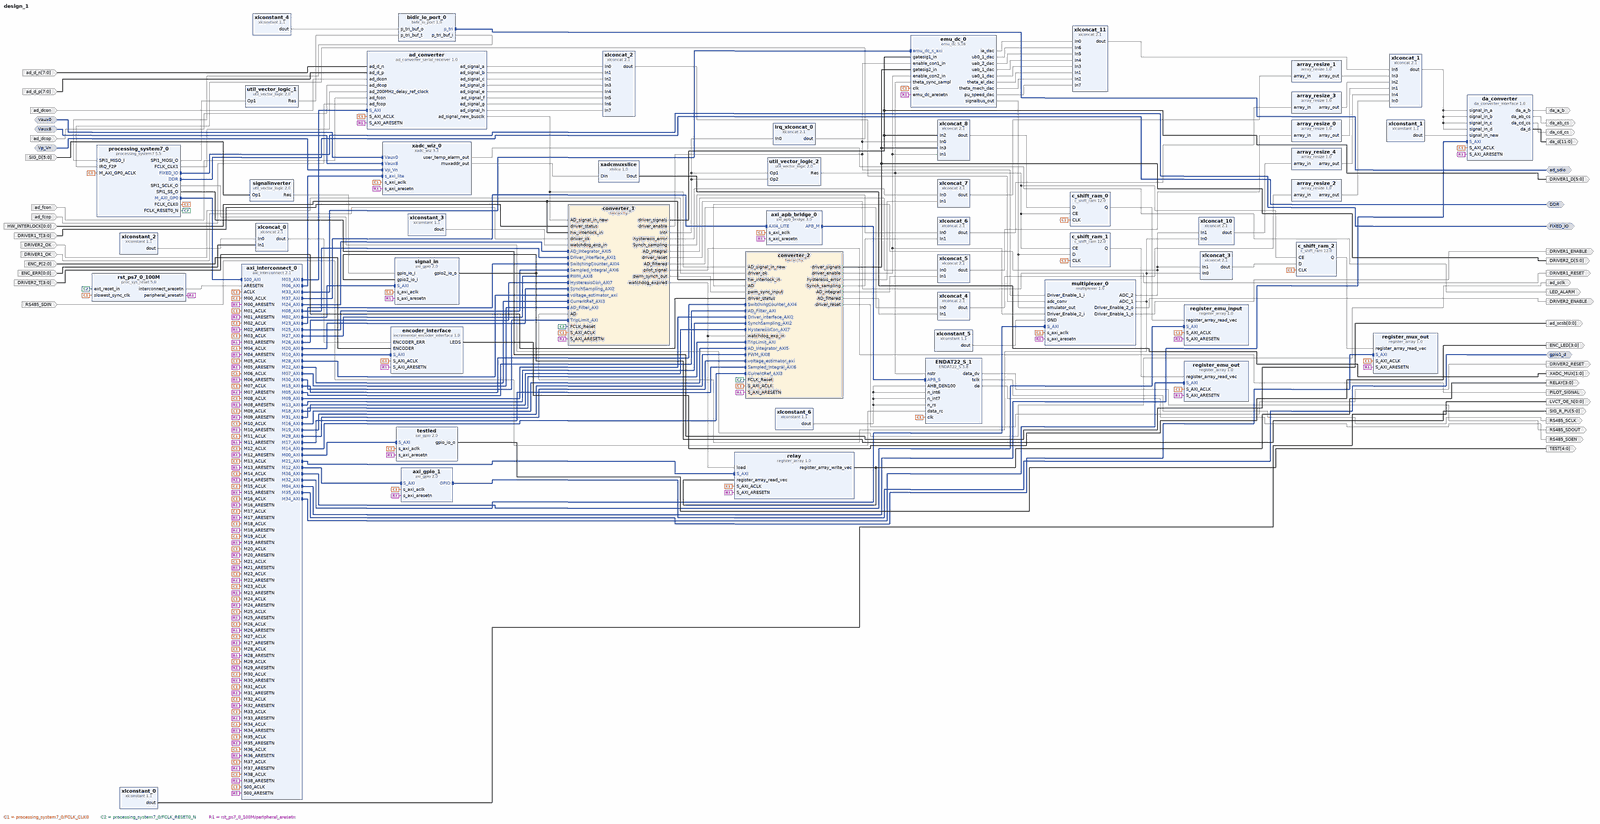
[diagram p0: block diagram of the top level, whole]
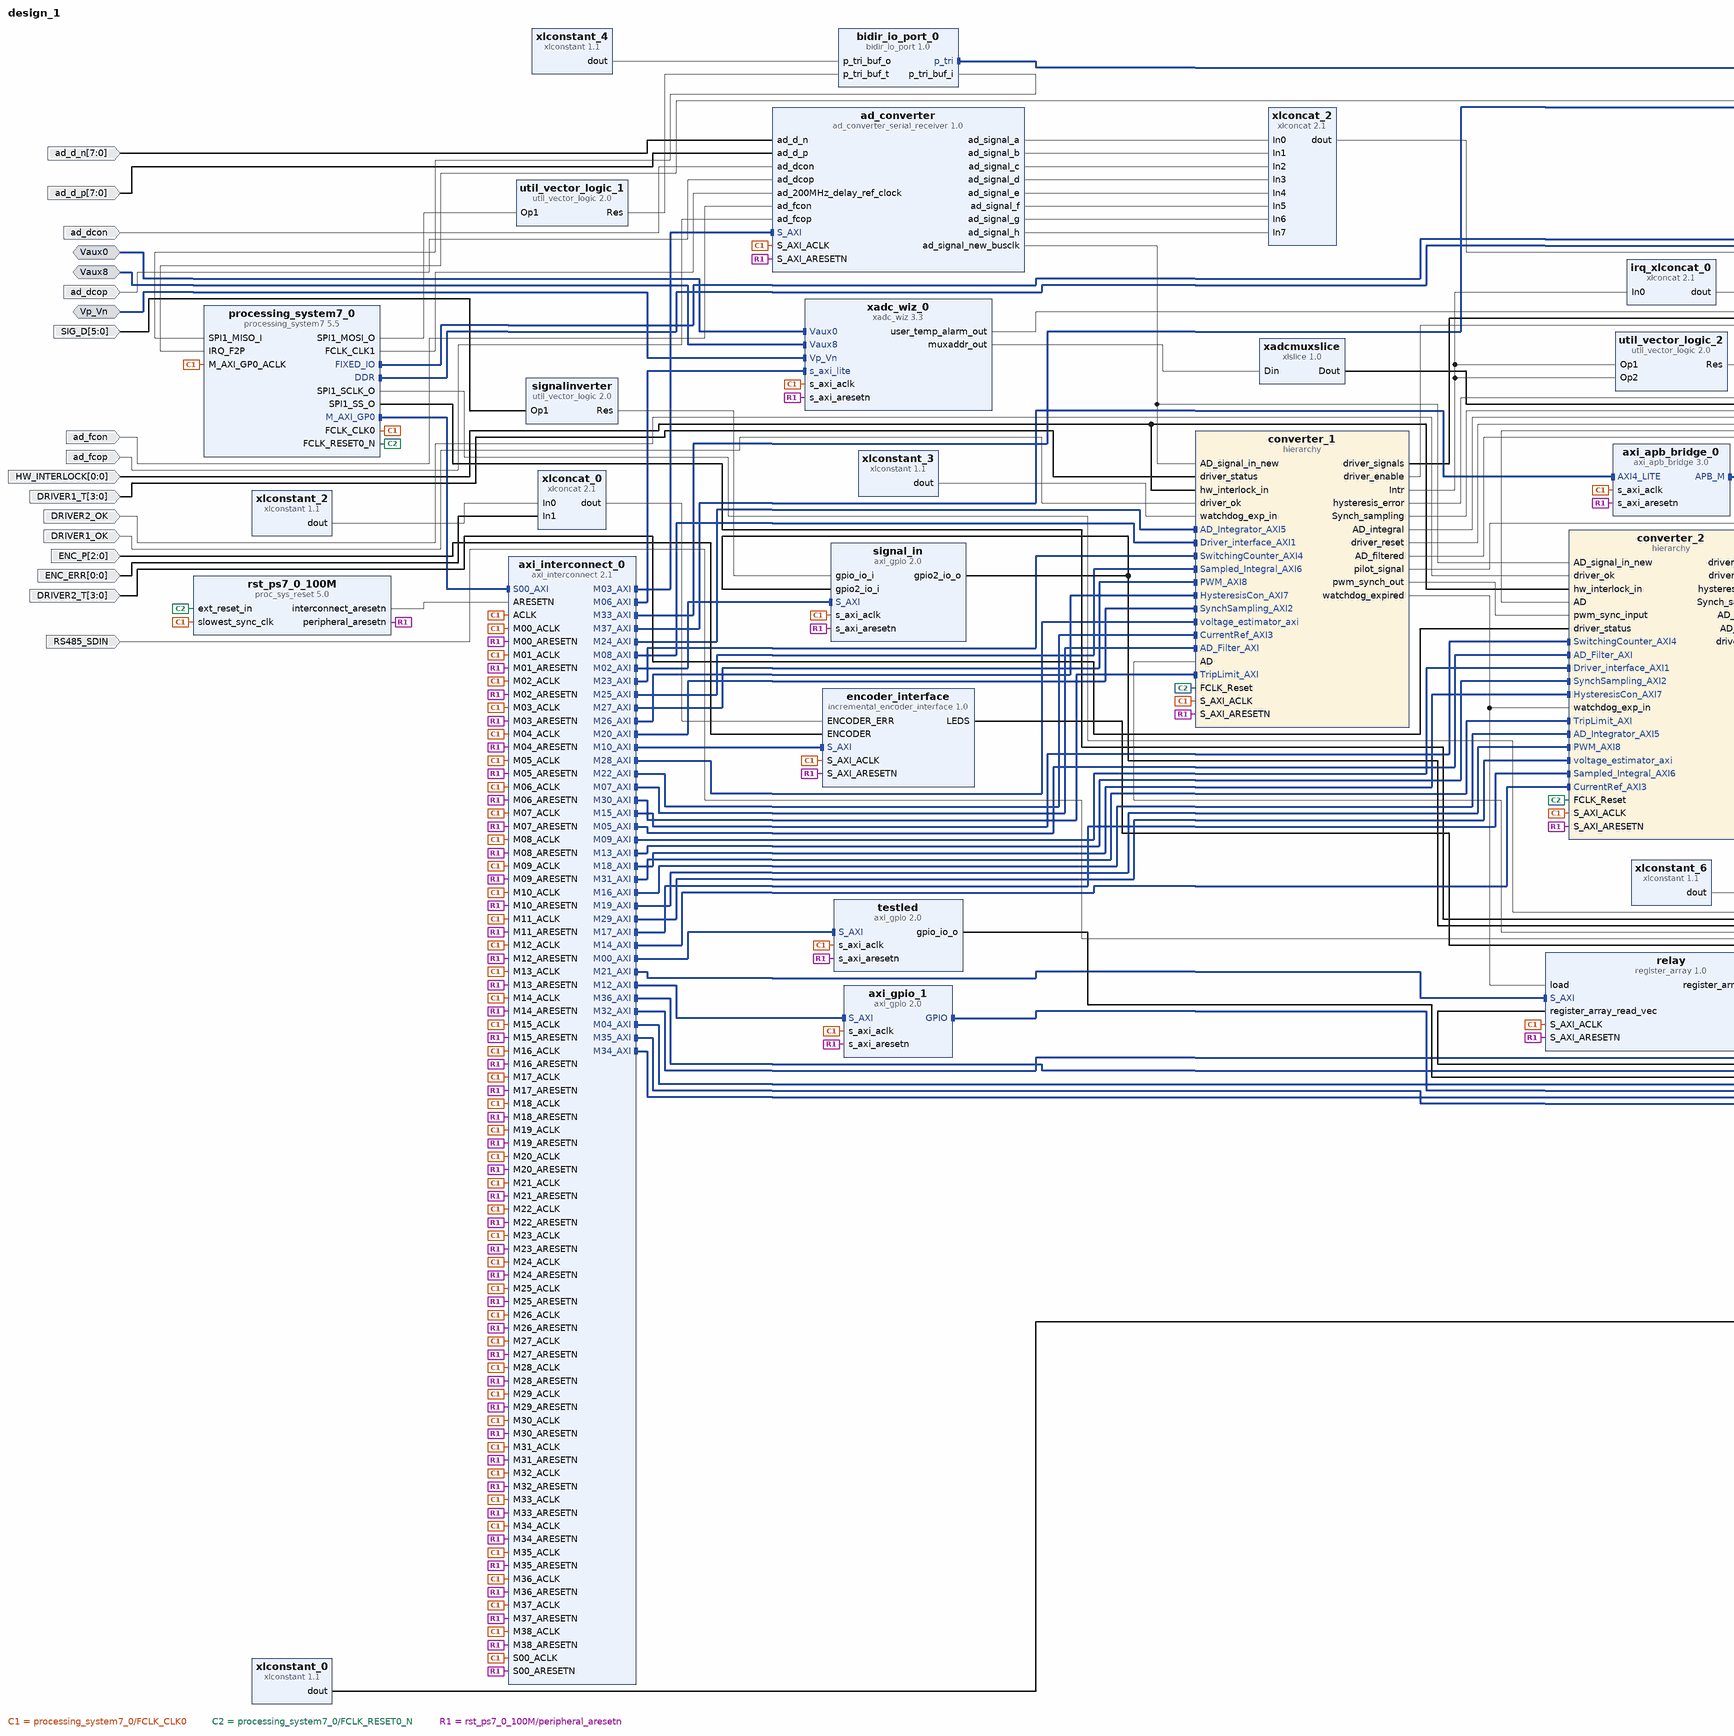
[diagram p1: block diagram of the top level, left part]
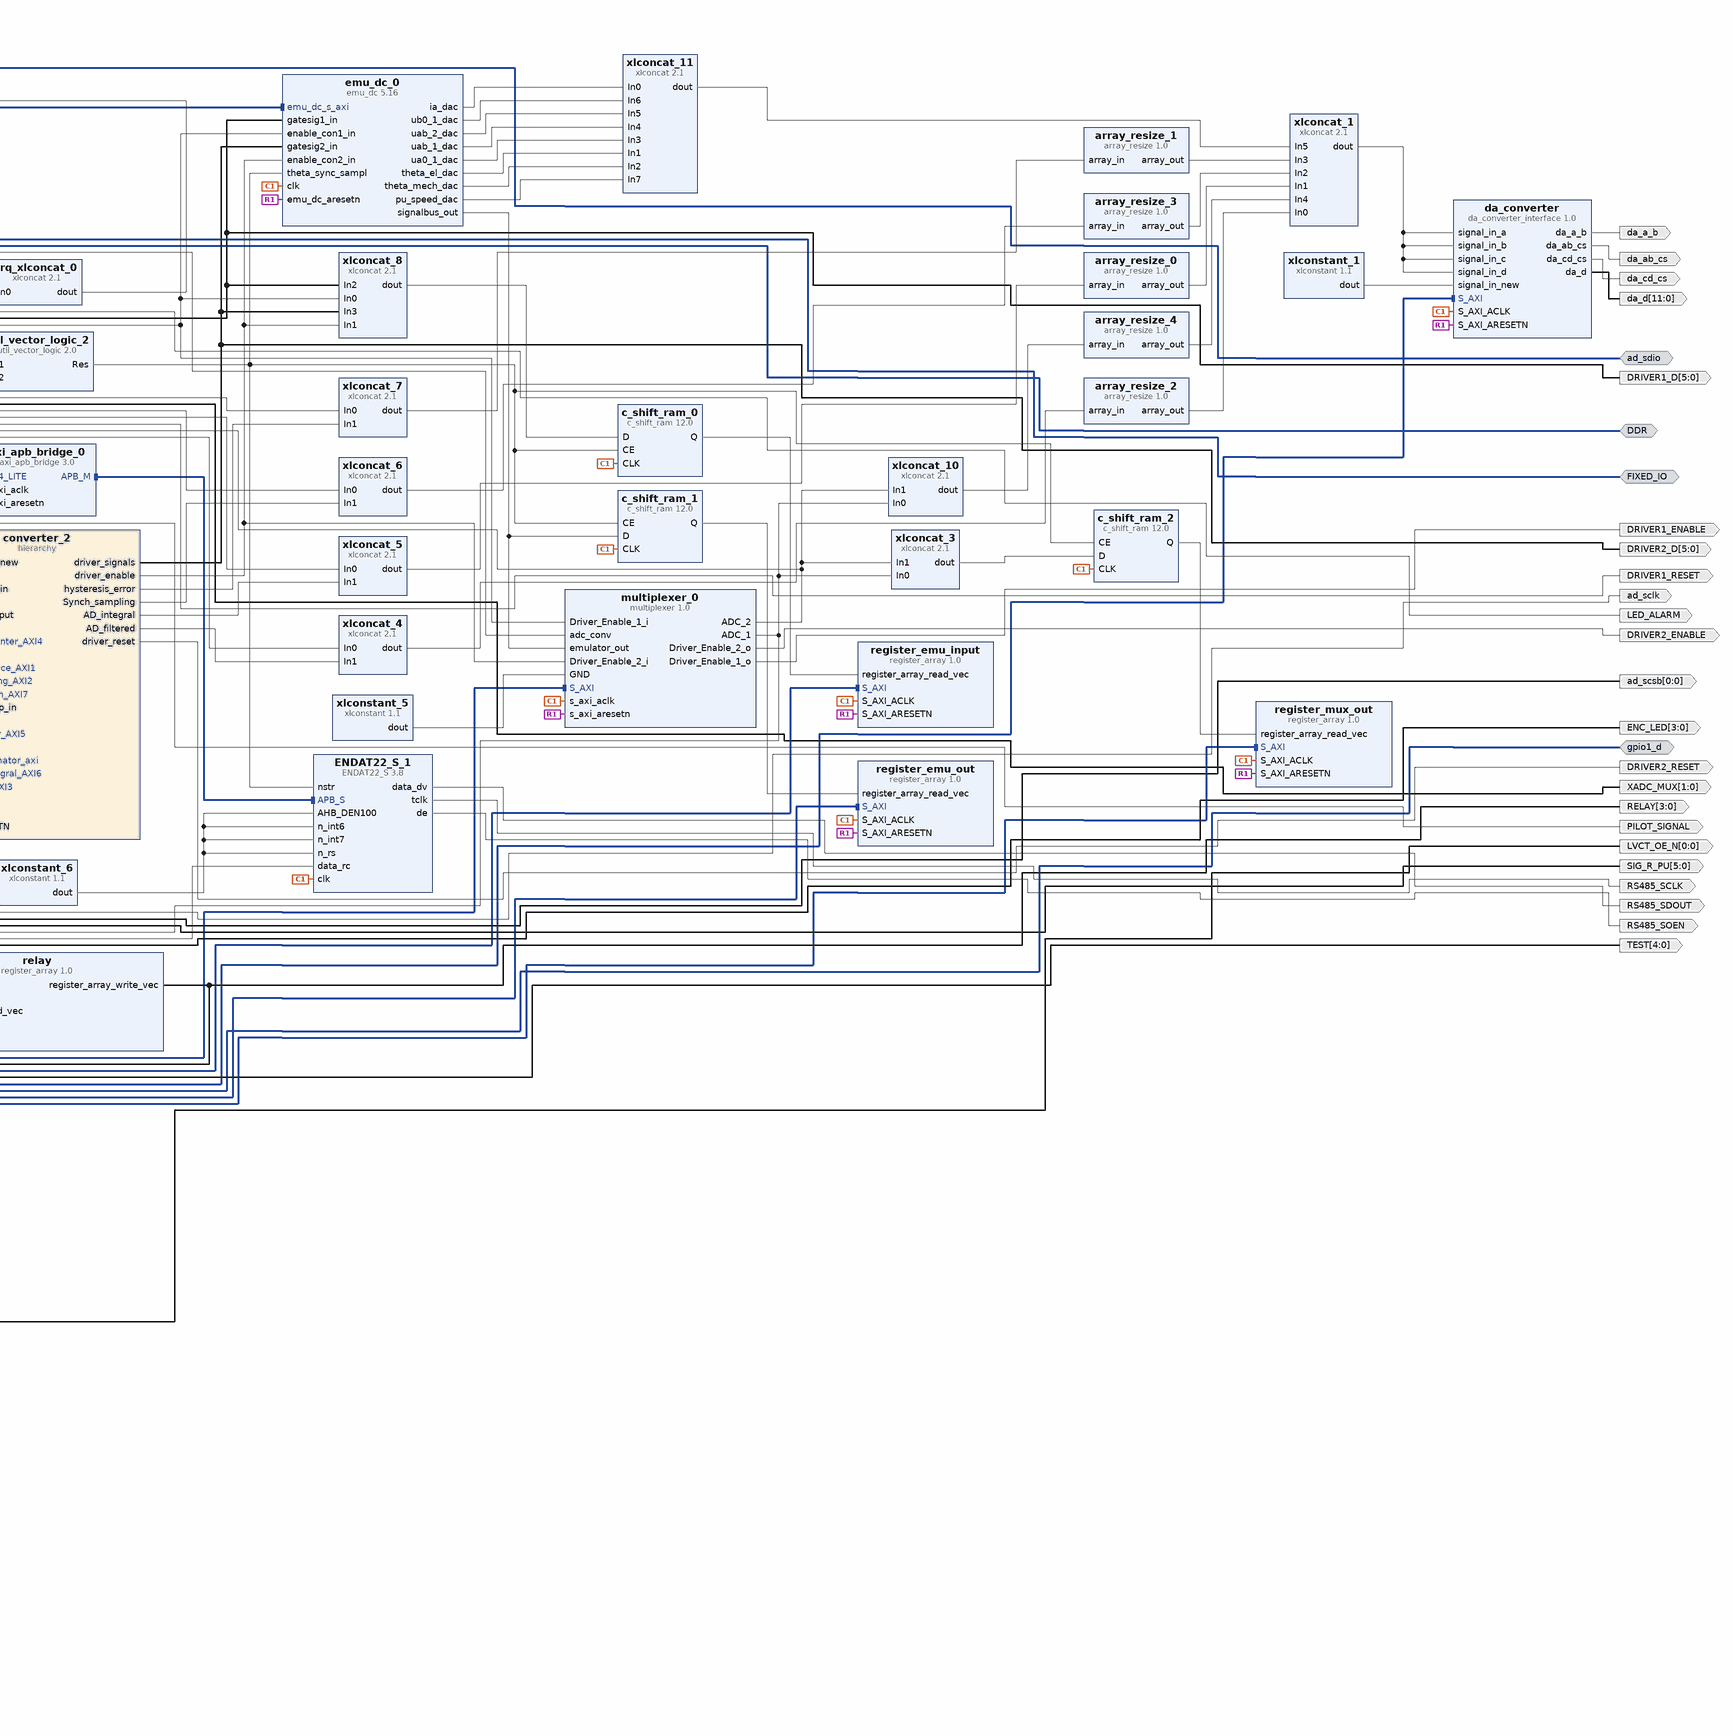
[diagram p2: block diagram of the top level, right part]
# Vivado block design design_1, xc7z030sbg485-1, Vivado 2019.1
create_bd_design design_1

create_bd_intf_port -mode Master -vlnv xilinx.com:interface:ddrx_rtl:1.0 DDR
create_bd_intf_port -mode Master -vlnv xilinx.com:display_processing_system7:fixedio_rtl:1.0 FIXED_IO
create_bd_intf_port -mode Slave -vlnv xilinx.com:interface:diff_analog_io_rtl:1.0 Vaux0
create_bd_intf_port -mode Slave -vlnv xilinx.com:interface:diff_analog_io_rtl:1.0 Vaux8
create_bd_intf_port -mode Slave -vlnv xilinx.com:interface:diff_analog_io_rtl:1.0 Vp_Vn
create_bd_intf_port -mode Master -vlnv xilinx.com:interface:gpio_rtl:1.0 ad_sdio
create_bd_intf_port -mode Master -vlnv xilinx.com:interface:gpio_rtl:1.0 gpio1_d
create_bd_port -dir I -from 2 -to 0 ENC_P
create_bd_port -dir I -from 0 -to 0 ENC_ERR
create_bd_port -dir I -from 5 -to 0 SIG_D
create_bd_port -dir I -from 7 -to 0 ad_d_n
create_bd_port -dir I -from 7 -to 0 ad_d_p
create_bd_port -dir I ad_dcon
create_bd_port -dir I ad_dcop
create_bd_port -dir I ad_fcon
create_bd_port -dir I ad_fcop
create_bd_port -dir O -from 4 -to 0 TEST
create_bd_port -dir O da_a_b
create_bd_port -dir O da_ab_cs
create_bd_port -dir O da_cd_cs
create_bd_port -dir O -from 11 -to 0 da_d
create_bd_port -dir I DRIVER2_OK
create_bd_port -dir I -from 3 -to 0 DRIVER2_T
create_bd_port -dir O -from 3 -to 0 ENC_LED
create_bd_port -dir O ad_sclk
create_bd_port -dir O -from 0 -to 0 ad_scsb
create_bd_port -dir O -from 3 -to 0 RELAY
create_bd_port -dir O -from 5 -to 0 SIG_R_PU
create_bd_port -dir O LED_ALARM
create_bd_port -dir O -from 0 -to 0 LVCT_OE_N
create_bd_port -dir O -from 1 -to 0 XADC_MUX
create_bd_port -dir O DRIVER1_RESET
create_bd_port -dir O DRIVER1_ENABLE
create_bd_port -dir O -from 5 -to 0 DRIVER1_D
create_bd_port -dir O PILOT_SIGNAL
create_bd_port -dir I -from 3 -to 0 DRIVER1_T
create_bd_port -dir I DRIVER1_OK
create_bd_port -dir I -from 0 -to 0 HW_INTERLOCK
create_bd_port -dir O DRIVER2_ENABLE
create_bd_port -dir O -from 5 -to 0 DRIVER2_D
create_bd_port -dir O DRIVER2_RESET
create_bd_port -dir I -type data RS485_SDIN
create_bd_port -dir O -type data RS485_SDOUT
create_bd_port -dir O -type clk RS485_SCLK
create_bd_port -dir O -type ce RS485_SOEN

create_bd_cell -type ip -vlnv sintef.no:user:ad_converter_serial_receiver:1.0 ad_converter
set_property -dict {CONFIG.AD_SIGNAL_IOBDELAY_VALUE 22} [get_bd_cells ad_converter]
create_bd_cell -type ip -vlnv sintef.no:user:array_resize:1.0 array_resize_0
set_property -dict [list \
  CONFIG.NUMBER_OF_ELEMENTS 10 \
  CONFIG.SHIFT_TO_TOP 1 \
  CONFIG.WIDTH_IN 24 \
  CONFIG.WIDTH_OUT 16 \
] [get_bd_cells array_resize_0]
create_bd_cell -type ip -vlnv sintef.no:user:array_resize:1.0 array_resize_1
set_property -dict [list \
  CONFIG.NUMBER_OF_ELEMENTS 6 \
  CONFIG.SHIFT_TO_TOP 1 \
  CONFIG.WIDTH_IN 14 \
  CONFIG.WIDTH_OUT 16 \
] [get_bd_cells array_resize_1]
create_bd_cell -type ip -vlnv sintef.no:user:array_resize:1.0 array_resize_2
set_property -dict [list \
  CONFIG.NUMBER_OF_ELEMENTS 8 \
  CONFIG.SHIFT_TO_TOP 1 \
  CONFIG.WIDTH_IN 13 \
  CONFIG.WIDTH_OUT 16 \
] [get_bd_cells array_resize_2]
create_bd_cell -type ip -vlnv sintef.no:user:array_resize:1.0 array_resize_3
set_property -dict [list \
  CONFIG.NUMBER_OF_ELEMENTS 8 \
  CONFIG.SHIFT_TO_TOP 1 \
  CONFIG.WIDTH_IN 13 \
  CONFIG.WIDTH_OUT 16 \
] [get_bd_cells array_resize_3]
create_bd_cell -type ip -vlnv sintef.no:user:bidir_io_port:1.0 bidir_io_port_0
create_bd_cell -type ip -vlnv sintef.no:user:da_converter_interface:1.0 da_converter
set_property -dict {CONFIG.NUMBER_OF_SIGNAL_SOURCES 48 CONFIG.USE_SCALING 1 CONFIG.WIDTH_IN 16} [get_bd_cells da_converter]
create_bd_cell -type ip -vlnv sintef.no:user:incremental_encoder_interface:1.0 encoder_interface
create_bd_cell -type ip -vlnv sintef.no:user:register_array:1.0 relay
set_property -dict {CONFIG.NUMBER_OF_REGISTERS 1 CONFIG.REGISTER_WIDTH 4} [get_bd_cells relay]
create_bd_cell -type ip -vlnv xilinx.com:ip:util_vector_logic:2.0 signalinverter
set_property -dict {CONFIG.C_OPERATION not CONFIG.C_SIZE 6} [get_bd_cells signalinverter]
create_bd_cell -type ip -vlnv xilinx.com:ip:util_vector_logic:2.0 util_vector_logic_1
set_property -dict {CONFIG.C_OPERATION not CONFIG.C_SIZE 1} [get_bd_cells util_vector_logic_1]
create_bd_cell -type hier converter_1
create_bd_cell -type hier converter_2
create_bd_cell -type ip -vlnv xilinx.com:ip:axi_gpio:2.0 axi_gpio_1
set_property -dict [list \
  CONFIG.C_ALL_OUTPUTS 0 \
  CONFIG.C_GPIO_WIDTH 16 \
  CONFIG.GPIO_BOARD_INTERFACE Custom \
  CONFIG.USE_BOARD_FLOW true \
] [get_bd_cells axi_gpio_1]
create_bd_cell -type ip -vlnv xilinx.com:ip:axi_interconnect:2.1 axi_interconnect_0
set_property -dict {CONFIG.NUM_MI 39 CONFIG.SYNCHRONIZATION_STAGES 2} [get_bd_cells axi_interconnect_0]
create_bd_cell -type ip -vlnv xilinx.com:ip:xlconcat:2.1 irq_xlconcat_0
set_property -dict {CONFIG.NUM_PORTS 1} [get_bd_cells irq_xlconcat_0]
create_bd_cell -type ip -vlnv xilinx.com:ip:processing_system7:5.5 processing_system7_0
set_property -dict [list \
  CONFIG.PCW_APU_PERIPHERAL_FREQMHZ 667 \
  CONFIG.PCW_CAN1_CAN1_IO {MIO 48 .. 49} \
  CONFIG.PCW_CAN1_PERIPHERAL_ENABLE 1 \
  CONFIG.PCW_ENET0_ENET0_IO {MIO 16 .. 27} \
  CONFIG.PCW_ENET0_GRP_MDIO_ENABLE 1 \
  CONFIG.PCW_ENET0_GRP_MDIO_IO {MIO 52 .. 53} \
  CONFIG.PCW_ENET0_PERIPHERAL_ENABLE 1 \
  CONFIG.PCW_ENET0_RESET_ENABLE 0 \
  CONFIG.PCW_ENET_RESET_ENABLE 1 \
  CONFIG.PCW_ENET_RESET_SELECT {Share reset pin} \
  CONFIG.PCW_EN_CLK1_PORT 1 \
  CONFIG.PCW_FCLK_CLK1_BUF TRUE \
  CONFIG.PCW_FPGA0_PERIPHERAL_FREQMHZ 100 \
  CONFIG.PCW_FPGA1_PERIPHERAL_FREQMHZ 200 \
  CONFIG.PCW_FPGA2_PERIPHERAL_FREQMHZ 33.333333 \
  CONFIG.PCW_FPGA_FCLK1_ENABLE 1 \
  CONFIG.PCW_GPIO_MIO_GPIO_ENABLE 1 \
  CONFIG.PCW_GPIO_MIO_GPIO_IO MIO \
  CONFIG.PCW_GPIO_PERIPHERAL_ENABLE 1 \
  CONFIG.PCW_I2C_RESET_ENABLE 0 \
  CONFIG.PCW_IRQ_F2P_INTR 1 \
  CONFIG.PCW_PERIPHERAL_BOARD_PRESET part0 \
  CONFIG.PCW_PRESET_BANK1_VOLTAGE {LVCMOS 1.8V} \
  CONFIG.PCW_QSPI_GRP_FBCLK_ENABLE 1 \
  CONFIG.PCW_QSPI_GRP_FBCLK_IO {MIO 8} \
  CONFIG.PCW_QSPI_GRP_SINGLE_SS_ENABLE 1 \
  CONFIG.PCW_QSPI_GRP_SINGLE_SS_IO {MIO 1 .. 6} \
  CONFIG.PCW_QSPI_PERIPHERAL_ENABLE 1 \
  CONFIG.PCW_QSPI_QSPI_IO {MIO 1 .. 6} \
  CONFIG.PCW_SD0_PERIPHERAL_ENABLE 0 \
  CONFIG.PCW_SD1_PERIPHERAL_ENABLE 1 \
  CONFIG.PCW_SD1_SD1_IO {MIO 10 .. 15} \
  CONFIG.PCW_SDIO_PERIPHERAL_FREQMHZ 25 \
  CONFIG.PCW_SINGLE_QSPI_DATA_MODE x4 \
  CONFIG.PCW_SPI0_PERIPHERAL_ENABLE 1 \
  CONFIG.PCW_SPI0_SPI0_IO {MIO 40 .. 45} \
  CONFIG.PCW_SPI1_PERIPHERAL_ENABLE 1 \
  CONFIG.PCW_SPI1_SPI1_IO EMIO \
  CONFIG.PCW_TTC0_PERIPHERAL_ENABLE 1 \
  CONFIG.PCW_TTC0_TTC0_IO EMIO \
  CONFIG.PCW_UART0_PERIPHERAL_ENABLE 1 \
  CONFIG.PCW_UART0_UART0_IO {MIO 50 .. 51} \
  CONFIG.PCW_UART1_PERIPHERAL_ENABLE 0 \
  CONFIG.PCW_UART_PERIPHERAL_FREQMHZ 50 \
  CONFIG.PCW_UIPARAM_DDR_FREQ_MHZ 533.333333 \
  CONFIG.PCW_UIPARAM_DDR_MEMORY_TYPE {DDR 3 (Low Voltage)} \
  CONFIG.PCW_UIPARAM_DDR_PARTNO {MT41K256M16 RE-125} \
  CONFIG.PCW_USB0_PERIPHERAL_ENABLE 1 \
  CONFIG.PCW_USB0_RESET_ENABLE 1 \
  CONFIG.PCW_USB0_RESET_IO {MIO 7} \
  CONFIG.PCW_USB0_USB0_IO {MIO 28 .. 39} \
  CONFIG.PCW_USB_RESET_ENABLE 1 \
  CONFIG.PCW_USB_RESET_SELECT {Share reset pin} \
  CONFIG.PCW_USE_FABRIC_INTERRUPT 1 \
] [get_bd_cells processing_system7_0]
# 522 more settings of processing_system7_0 are not shown: defaults, MIO pin electricals, DDR timing, and values the tool derives
create_bd_cell -type ip -vlnv xilinx.com:ip:proc_sys_reset:5.0 rst_ps7_0_100M
create_bd_cell -type ip -vlnv xilinx.com:ip:axi_gpio:2.0 signal_in
set_property -dict [list \
  CONFIG.C_ALL_OUTPUTS 0 \
  CONFIG.C_GPIO2_WIDTH 6 \
  CONFIG.C_GPIO_WIDTH 6 \
  CONFIG.C_IS_DUAL 1 \
  CONFIG.GPIO_BOARD_INTERFACE Custom \
  CONFIG.USE_BOARD_FLOW true \
] [get_bd_cells signal_in]
create_bd_cell -type ip -vlnv xilinx.com:ip:axi_gpio:2.0 testled
set_property -dict {CONFIG.C_GPIO_WIDTH 5 CONFIG.C_IS_DUAL 0} [get_bd_cells testled]
create_bd_cell -type ip -vlnv xilinx.com:ip:xadc_wiz:3.3 xadc_wiz_0
set_property -dict [list \
  CONFIG.CHANNEL_ENABLE_VAUXP0_VAUXN0 true \
  CONFIG.CHANNEL_ENABLE_VAUXP8_VAUXN8 true \
  CONFIG.CHANNEL_ENABLE_VP_VN false \
  CONFIG.ENABLE_EXTERNAL_MUX true \
  CONFIG.ENABLE_RESET false \
  CONFIG.EXTERNAL_MUX_CHANNEL VAUXP0_VAUXN0 \
  CONFIG.INTERFACE_SELECTION Enable_AXI \
  CONFIG.SEQUENCER_MODE Off \
  CONFIG.SINGLE_CHANNEL_SELECTION VP_VN \
  CONFIG.XADC_STARUP_SELECTION simultaneous_sampling \
] [get_bd_cells xadc_wiz_0]
create_bd_cell -type ip -vlnv xilinx.com:ip:xlslice:1.0 xadcmuxslice
set_property -dict {CONFIG.DIN_FROM 1 CONFIG.DIN_TO 0 CONFIG.DIN_WIDTH 5 CONFIG.DOUT_WIDTH 2} [get_bd_cells xadcmuxslice]
create_bd_cell -type ip -vlnv xilinx.com:ip:xlconcat:2.1 xlconcat_0
set_property -dict {CONFIG.dout_width 4} [get_bd_cells xlconcat_0]
create_bd_cell -type ip -vlnv xilinx.com:ip:xlconcat:2.1 xlconcat_1
set_property -dict {CONFIG.NUM_PORTS 6 CONFIG.dout_width 768} [get_bd_cells xlconcat_1]
create_bd_cell -type ip -vlnv xilinx.com:ip:xlconcat:2.1 xlconcat_2
set_property -dict [list \
  CONFIG.IN0_WIDTH 13 \
  CONFIG.IN1_WIDTH 13 \
  CONFIG.IN2_WIDTH 13 \
  CONFIG.IN3_WIDTH 13 \
  CONFIG.IN4_WIDTH 13 \
  CONFIG.IN5_WIDTH 13 \
  CONFIG.IN6_WIDTH 13 \
  CONFIG.IN7_WIDTH 13 \
  CONFIG.NUM_PORTS 8 \
  CONFIG.dout_width 104 \
] [get_bd_cells xlconcat_2]
create_bd_cell -type ip -vlnv xilinx.com:ip:xlconcat:2.1 xlconcat_4
set_property -dict {CONFIG.IN0_WIDTH 52 CONFIG.IN1_WIDTH 52 CONFIG.NUM_PORTS 2 CONFIG.dout_width 104} [get_bd_cells xlconcat_4]
create_bd_cell -type ip -vlnv xilinx.com:ip:xlconcat:2.1 xlconcat_5
set_property -dict {CONFIG.NUM_PORTS 2 CONFIG.dout_width 240} [get_bd_cells xlconcat_5]
create_bd_cell -type ip -vlnv xilinx.com:ip:xlconcat:2.1 xlconcat_6
set_property -dict {CONFIG.IN0_WIDTH 52 CONFIG.IN1_WIDTH 52 CONFIG.NUM_PORTS 2 CONFIG.dout_width 104} [get_bd_cells xlconcat_6]
create_bd_cell -type ip -vlnv xilinx.com:ip:xlconcat:2.1 xlconcat_7
set_property -dict {CONFIG.IN0_WIDTH 42 CONFIG.IN1_WIDTH 42 CONFIG.NUM_PORTS 2 CONFIG.dout_width 84} [get_bd_cells xlconcat_7]
create_bd_cell -type ip -vlnv xilinx.com:ip:xlconstant:1.1 xlconstant_0
set_property -dict {CONFIG.CONST_VAL 0} [get_bd_cells xlconstant_0]
create_bd_cell -type ip -vlnv xilinx.com:ip:xlconstant:1.1 xlconstant_1
set_property -dict {CONFIG.CONST_VAL -1 CONFIG.CONST_WIDTH 4} [get_bd_cells xlconstant_1]
create_bd_cell -type ip -vlnv xilinx.com:ip:xlconstant:1.1 xlconstant_3
set_property -dict {CONFIG.CONST_VAL 0 CONFIG.CONST_WIDTH 1} [get_bd_cells xlconstant_3]
create_bd_cell -type ip -vlnv xilinx.com:ip:xlconstant:1.1 xlconstant_2
set_property -dict {CONFIG.CONST_VAL 0 CONFIG.CONST_WIDTH 3} [get_bd_cells xlconstant_2]
create_bd_cell -type ip -vlnv xilinx.com:ip:xlconstant:1.1 xlconstant_4
set_property -dict {CONFIG.CONST_VAL 1 CONFIG.CONST_WIDTH 1} [get_bd_cells xlconstant_4]
create_bd_cell -type ip -vlnv ntnu.no:user:multiplexer:1.0 multiplexer_0
create_bd_cell -type ip -vlnv xilinx.com:ip:xlconstant:1.1 xlconstant_5
set_property -dict {CONFIG.CONST_VAL 0} [get_bd_cells xlconstant_5]
create_bd_cell -type ip -vlnv sintef.no:user:register_array:1.0 register_emu_out
set_property -dict {CONFIG.NUMBER_OF_REGISTERS 8 CONFIG.REGISTER_WIDTH 13 CONFIG.REG_SIGNED 1} [get_bd_cells register_emu_out]
create_bd_cell -type ip -vlnv sintef.no:user:register_array:1.0 register_mux_out
set_property -dict {CONFIG.NUMBER_OF_REGISTERS 8 CONFIG.REGISTER_WIDTH 13 CONFIG.REG_SIGNED 1} [get_bd_cells register_mux_out]
create_bd_cell -type ip -vlnv xilinx.com:ip:xlconcat:2.1 xlconcat_3
create_bd_cell -type ip -vlnv sintef.no:user:register_array:1.0 register_emu_input
set_property -dict {CONFIG.NUMBER_OF_REGISTERS 1 CONFIG.REGISTER_WIDTH 14 CONFIG.REG_SIGNED 1} [get_bd_cells register_emu_input]
create_bd_cell -type ip -vlnv xilinx.com:ip:xlconcat:2.1 xlconcat_8
set_property -dict {CONFIG.NUM_PORTS 4} [get_bd_cells xlconcat_8]
create_bd_cell -type ip -vlnv xilinx.com:ip:c_shift_ram:12.0 c_shift_ram_0
set_property -dict [list \
  CONFIG.AsyncInitVal 00000000000000 \
  CONFIG.CE true \
  CONFIG.DefaultData 00000000000000 \
  CONFIG.Depth 1 \
  CONFIG.Width 14 \
] [get_bd_cells c_shift_ram_0]
create_bd_cell -type ip -vlnv xilinx.com:ip:c_shift_ram:12.0 c_shift_ram_1
set_property -dict [list \
  CONFIG.AsyncInitVal 00000000000000000000000000000000000000000000000000000000000000000000000000000000000000000000000000000000 \
  CONFIG.CE true \
  CONFIG.DefaultData 00000000000000000000000000000000000000000000000000000000000000000000000000000000000000000000000000000000 \
  CONFIG.Depth 1 \
  CONFIG.Width 104 \
] [get_bd_cells c_shift_ram_1]
create_bd_cell -type ip -vlnv xilinx.com:ip:c_shift_ram:12.0 c_shift_ram_2
set_property -dict [list \
  CONFIG.AsyncInitVal 00000000000000000000000000000000000000000000000000000000000000000000000000000000000000000000000000000000 \
  CONFIG.CE true \
  CONFIG.DefaultData 00000000000000000000000000000000000000000000000000000000000000000000000000000000000000000000000000000000 \
  CONFIG.Depth 1 \
  CONFIG.Width 104 \
] [get_bd_cells c_shift_ram_2]
create_bd_cell -type ip -vlnv sintef.no:user:array_resize:1.0 array_resize_4
set_property -dict [list \
  CONFIG.NUMBER_OF_ELEMENTS 8 \
  CONFIG.SHIFT_TO_TOP 1 \
  CONFIG.WIDTH_IN 13 \
  CONFIG.WIDTH_OUT 16 \
] [get_bd_cells array_resize_4]
create_bd_cell -type ip -vlnv xilinx.com:ip:xlconcat:2.1 xlconcat_10
set_property -dict {CONFIG.NUM_PORTS 2 CONFIG.dout_width 104} [get_bd_cells xlconcat_10]
create_bd_cell -type ip -vlnv xilinx.com:ip:util_vector_logic:2.0 util_vector_logic_2
set_property -dict {CONFIG.C_SIZE 1} [get_bd_cells util_vector_logic_2]
create_bd_cell -type ip -vlnv xilinx.com:ip:xlconcat:2.1 xlconcat_11
set_property -dict {CONFIG.NUM_PORTS 8} [get_bd_cells xlconcat_11]
create_bd_cell -type ip -vlnv PESC_NTNU:SysGen:emu_dc:5.16 emu_dc_0
create_bd_cell -type ip -vlnv ntnu.no:user:ENDAT22_S:3.8 ENDAT22_S_1
create_bd_cell -type ip -vlnv xilinx.com:ip:axi_apb_bridge:3.0 axi_apb_bridge_0
set_property -dict {CONFIG.C_APB_NUM_SLAVES 1} [get_bd_cells axi_apb_bridge_0]
create_bd_cell -type ip -vlnv xilinx.com:ip:xlconstant:1.1 xlconstant_6

# ---- hierarchy /converter_1 ----
current_bd_instance /converter_1
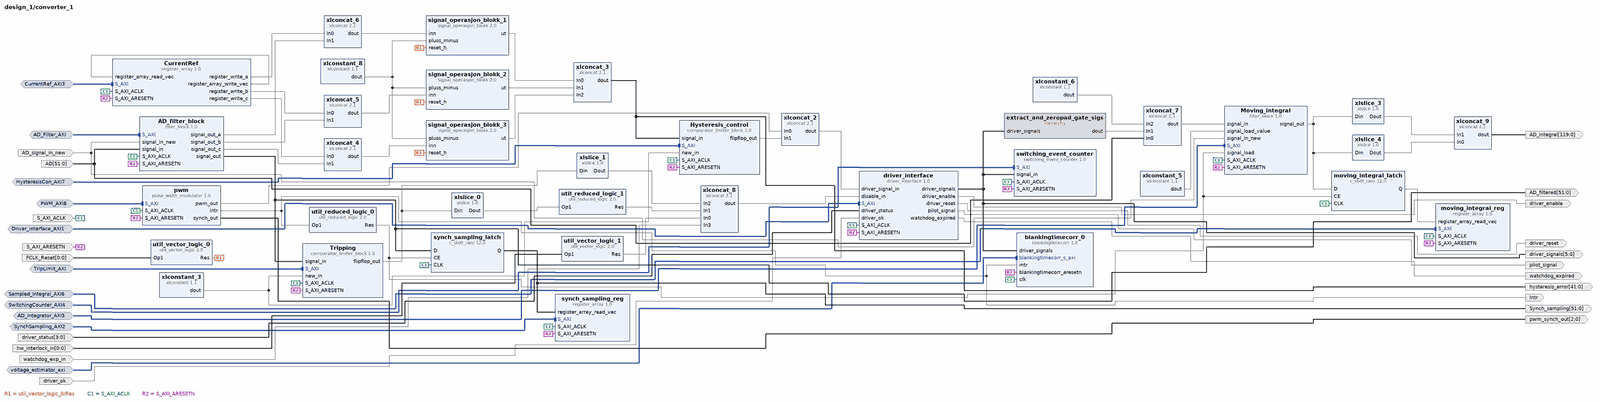
[diagram p3: block diagram inside /converter_1, whole]
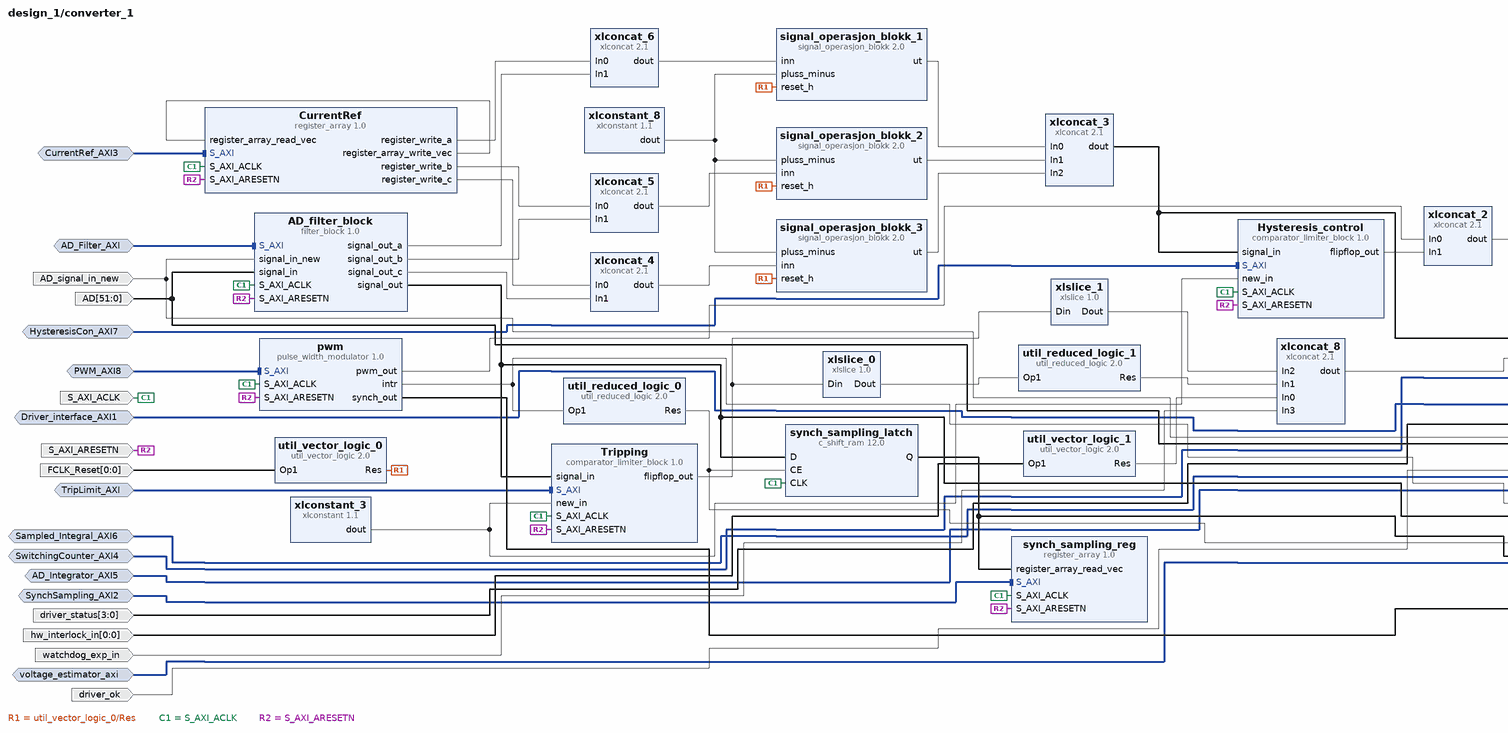
[diagram p4: block diagram inside /converter_1, left part]
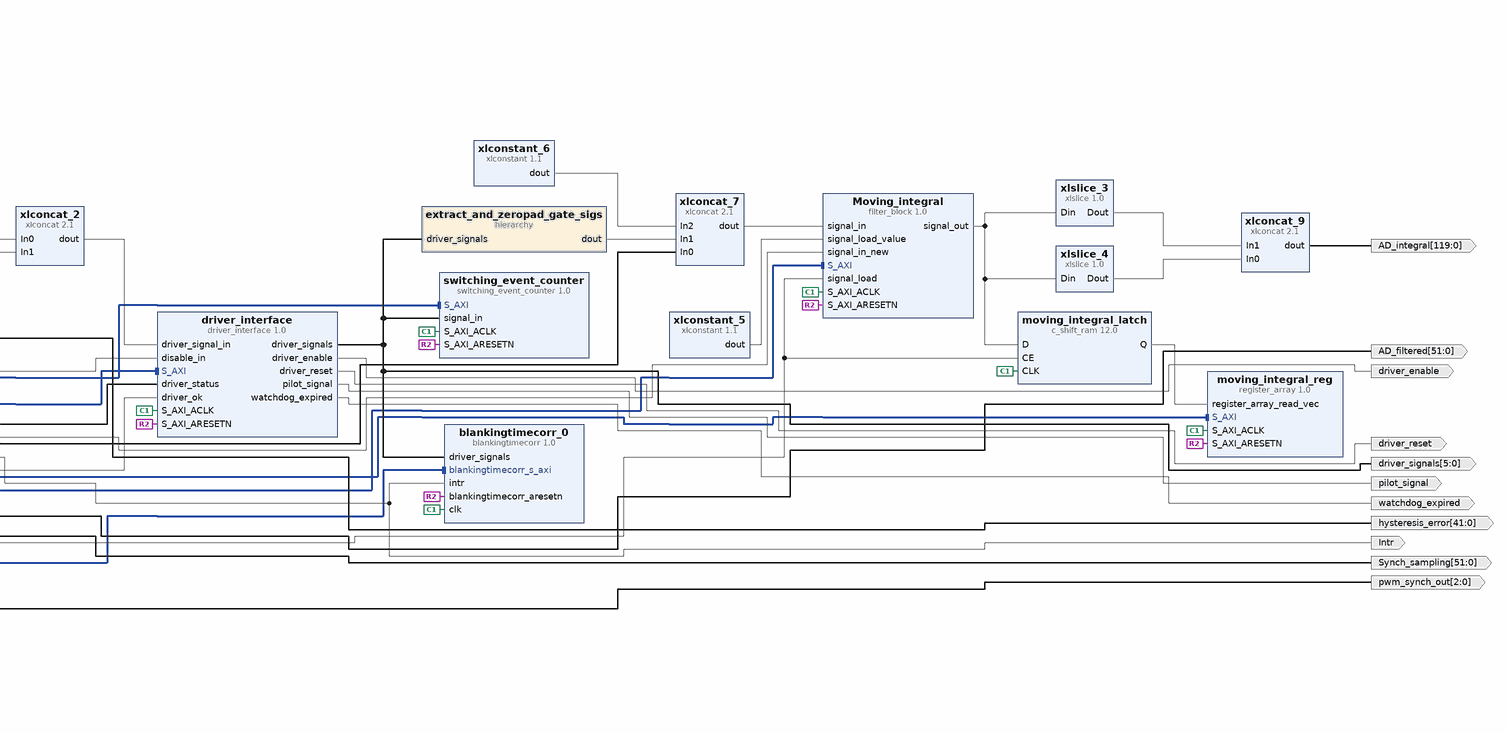
[diagram p5: block diagram inside /converter_1, right part]
create_bd_intf_pin -mode Slave -vlnv xilinx.com:interface:aximm_rtl:1.0 AD_Filter_AXI
create_bd_intf_pin -mode Slave -vlnv xilinx.com:interface:aximm_rtl:1.0 Driver_interface_AXI1
create_bd_intf_pin -mode Slave -vlnv xilinx.com:interface:aximm_rtl:1.0 SynchSampling_AXI2
create_bd_intf_pin -mode Slave -vlnv xilinx.com:interface:aximm_rtl:1.0 CurrentRef_AXI3
create_bd_intf_pin -mode Slave -vlnv xilinx.com:interface:aximm_rtl:1.0 SwitchingCounter_AXI4
create_bd_intf_pin -mode Slave -vlnv xilinx.com:interface:aximm_rtl:1.0 AD_Integrator_AXI5
create_bd_intf_pin -mode Slave -vlnv xilinx.com:interface:aximm_rtl:1.0 Sampled_Integral_AXI6
create_bd_intf_pin -mode Slave -vlnv xilinx.com:interface:aximm_rtl:1.0 HysteresisCon_AXI7
create_bd_intf_pin -mode Slave -vlnv xilinx.com:interface:aximm_rtl:1.0 PWM_AXI8
create_bd_intf_pin -mode Slave -vlnv xilinx.com:interface:aximm_rtl:1.0 voltage_estimator_axi
create_bd_intf_pin -mode Slave -vlnv xilinx.com:interface:aximm_rtl:1.0 TripLimit_AXI
create_bd_pin -dir I AD_signal_in_new
create_bd_pin -dir O -from 51 -to 0 -type data AD_filtered
create_bd_pin -dir I -type clk S_AXI_ACLK
create_bd_pin -dir I -type rst S_AXI_ARESETN
create_bd_pin -dir I -from 3 -to 0 driver_status
create_bd_pin -dir I driver_ok
create_bd_pin -dir O driver_enable
create_bd_pin -dir O -from 5 -to 0 driver_signals
create_bd_pin -dir O driver_reset
create_bd_pin -dir I -from 0 -to 0 hw_interlock_in
create_bd_pin -dir I -from 0 -to 0 FCLK_Reset
create_bd_pin -dir O -from 41 -to 0 hysteresis_error
create_bd_pin -dir O -from 119 -to 0 AD_integral
create_bd_pin -dir O Intr
create_bd_pin -dir O pilot_signal
create_bd_pin -dir O watchdog_expired
create_bd_pin -dir I -from 51 -to 0 AD
create_bd_pin -dir O -from 51 -to 0 Synch_sampling
create_bd_pin -dir I watchdog_exp_in
create_bd_pin -dir O -from 2 -to 0 pwm_synch_out

create_bd_cell -type ip -vlnv sintef.no:user:filter_block:1.0 AD_filter_block
set_property -dict [list \
  CONFIG.NUMBER_OF_CHANNELS 4 \
  CONFIG.SIGNAL_IN_WIDTH 13 \
  CONFIG.SIGNAL_OUT_WIDTH 13 \
] [get_bd_cells AD_filter_block]
create_bd_cell -type ip -vlnv sintef.no:user:driver_interface:1.0 driver_interface
set_property -dict [list \
  CONFIG.NUMBER_OF_DISABLE_IN_SIGNALS 4 \
  CONFIG.NUMBER_OF_SIGNAL_SOURCES 2 \
  CONFIG.USE_WATCHDOG_TIMER 1 \
] [get_bd_cells driver_interface]
create_bd_cell -type ip -vlnv sintef.no:user:register_array:1.0 synch_sampling_reg
set_property -dict {CONFIG.NUMBER_OF_REGISTERS 4 CONFIG.REGISTER_WIDTH 13 CONFIG.REG_SIGNED 1} [get_bd_cells synch_sampling_reg]
create_bd_cell -type ip -vlnv xilinx.com:ip:util_vector_logic:2.0 util_vector_logic_0
set_property -dict {CONFIG.C_OPERATION not CONFIG.C_SIZE 1} [get_bd_cells util_vector_logic_0]
create_bd_cell -type ip -vlnv sintef.no:user:register_array:1.0 CurrentRef
set_property -dict {CONFIG.NUMBER_OF_REGISTERS 3 CONFIG.REGISTER_WIDTH 13 CONFIG.REG_SIGNED 1} [get_bd_cells CurrentRef]
create_bd_cell -type ip -vlnv sintef.no:user:switching_event_counter:1.0 switching_event_counter
set_property -dict {CONFIG.NUMBER_OF_CHANNELS 6} [get_bd_cells switching_event_counter]
create_bd_cell -type ip -vlnv sintef.no:user:filter_block:1.0 Moving_integral
set_property -dict [list \
  CONFIG.NUMBER_OF_CHANNELS 8 \
  CONFIG.OPERATION_MODE 0 \
  CONFIG.SIGNAL_IN_WIDTH 13 \
  CONFIG.SIGNAL_OUT_WIDTH 24 \
] [get_bd_cells Moving_integral]
create_bd_cell -type ip -vlnv sintef.no:user:register_array:1.0 moving_integral_reg
set_property -dict {CONFIG.NUMBER_OF_REGISTERS 8 CONFIG.REGISTER_WIDTH 24 CONFIG.REG_SIGNED 1} [get_bd_cells moving_integral_reg]
create_bd_cell -type ip -vlnv sintef.no:user:comparator_limiter_block:1.0 Hysteresis_control
set_property -dict [list \
  CONFIG.NUMBER_OF_CHANNELS 3 \
  CONFIG.READ_CLIPPED_SIGNALS 0 \
  CONFIG.WIDTH_IN 14 \
  CONFIG.WIDTH_OUT 13 \
] [get_bd_cells Hysteresis_control]
create_bd_cell -type ip -vlnv sintef.no:user:pulse_width_modulator:1.0 pwm
set_property -dict {CONFIG.HYSTERESIS_DEFAULT_VALUE 0 CONFIG.INTERRUPT_DIVISOR_WIDTH 8} [get_bd_cells pwm]
create_bd_cell -type ip -vlnv xilinx.com:ip:util_vector_logic:2.0 util_vector_logic_1
set_property -dict {CONFIG.C_OPERATION not CONFIG.C_SIZE 1} [get_bd_cells util_vector_logic_1]
create_bd_cell -type ip -vlnv sintef.no:user:comparator_limiter_block:1.0 Tripping
set_property -dict [list \
  CONFIG.NUMBER_OF_CHANNELS 4 \
  CONFIG.READ_CLIPPED_SIGNALS 0 \
  CONFIG.REFERENCE_SELECTOR 0 \
  CONFIG.REGISTER_CLEAR_MASK 0x00000000 \
  CONFIG.REGISTER_SET_MASK 0x00000003 \
  CONFIG.SEPARATE_REFERENCES 1 \
  CONFIG.WIDTH_IN 13 \
  CONFIG.WIDTH_OUT 13 \
] [get_bd_cells Tripping]
create_bd_cell -type ip -vlnv xilinx.com:ip:c_shift_ram:12.0 moving_integral_latch
set_property -dict [list \
  CONFIG.AsyncInitVal 000000000000000000000000000000000000000000000000000000000000000000000000000000000000000000000000000000000000000000000000000000000000000000000000000000000000000000000000000000000000000000000000 \
  CONFIG.CE true \
  CONFIG.DefaultData 000000000000000000000000000000000000000000000000000000000000000000000000000000000000000000000000000000000000000000000000000000000000000000000000000000000000000000000000000000000000000000000000 \
  CONFIG.Depth 1 \
  CONFIG.Width 192 \
] [get_bd_cells moving_integral_latch]
create_bd_cell -type ip -vlnv xilinx.com:ip:c_shift_ram:12.0 synch_sampling_latch
set_property -dict [list \
  CONFIG.AsyncInitVal 0000000000000000000000000000000000000000000000000000 \
  CONFIG.CE true \
  CONFIG.DefaultData 0000000000000000000000000000000000000000000000000000 \
  CONFIG.Depth 1 \
  CONFIG.Width 52 \
] [get_bd_cells synch_sampling_latch]
create_bd_cell -type ip -vlnv xilinx.com:ip:util_reduced_logic:2.0 util_reduced_logic_0
set_property -dict {CONFIG.C_SIZE 1} [get_bd_cells util_reduced_logic_0]
create_bd_cell -type ip -vlnv xilinx.com:ip:util_reduced_logic:2.0 util_reduced_logic_1
set_property -dict {CONFIG.C_OPERATION or CONFIG.C_SIZE 3} [get_bd_cells util_reduced_logic_1]
create_bd_cell -type ip -vlnv xilinx.com:ip:xlconcat:2.1 xlconcat_2
set_property -dict {CONFIG.dout_width 6} [get_bd_cells xlconcat_2]
create_bd_cell -type ip -vlnv xilinx.com:ip:xlconcat:2.1 xlconcat_8
set_property -dict {CONFIG.IN0_WIDTH 1 CONFIG.IN1_WIDTH 1 CONFIG.NUM_PORTS 4 CONFIG.dout_width 4} [get_bd_cells xlconcat_8]
create_bd_cell -type ip -vlnv xilinx.com:ip:xlconcat:2.1 xlconcat_3
set_property -dict {CONFIG.NUM_PORTS 3 CONFIG.dout_width 42} [get_bd_cells xlconcat_3]
create_bd_cell -type ip -vlnv xilinx.com:ip:xlconcat:2.1 xlconcat_4
set_property -dict {CONFIG.NUM_PORTS 2 CONFIG.dout_width 26} [get_bd_cells xlconcat_4]
create_bd_cell -type ip -vlnv xilinx.com:ip:xlconcat:2.1 xlconcat_5
set_property -dict {CONFIG.NUM_PORTS 2 CONFIG.dout_width 26} [get_bd_cells xlconcat_5]
create_bd_cell -type ip -vlnv xilinx.com:ip:xlconcat:2.1 xlconcat_6
set_property -dict {CONFIG.NUM_PORTS 2 CONFIG.dout_width 26} [get_bd_cells xlconcat_6]
create_bd_cell -type ip -vlnv xilinx.com:ip:xlconcat:2.1 xlconcat_7
set_property -dict [list \
  CONFIG.IN0_WIDTH 52 \
  CONFIG.IN1_WIDTH 39 \
  CONFIG.IN2_WIDTH 13 \
  CONFIG.NUM_PORTS 3 \
  CONFIG.dout_width 104 \
] [get_bd_cells xlconcat_7]
create_bd_cell -type ip -vlnv xilinx.com:ip:xlconstant:1.1 xlconstant_3
set_property -dict {CONFIG.CONST_VAL 1 CONFIG.CONST_WIDTH 1} [get_bd_cells xlconstant_3]
create_bd_cell -type ip -vlnv xilinx.com:ip:xlconstant:1.1 xlconstant_5
set_property -dict {CONFIG.CONST_VAL 0 CONFIG.CONST_WIDTH 192} [get_bd_cells xlconstant_5]
create_bd_cell -type ip -vlnv xilinx.com:ip:xlconstant:1.1 xlconstant_8
set_property -dict {CONFIG.CONST_VAL 2 CONFIG.CONST_WIDTH 2} [get_bd_cells xlconstant_8]
create_bd_cell -type ip -vlnv xilinx.com:ip:xlconstant:1.1 xlconstant_6
set_property -dict {CONFIG.CONST_VAL 1 CONFIG.CONST_WIDTH 13} [get_bd_cells xlconstant_6]
create_bd_cell -type ip -vlnv xilinx.com:ip:xlslice:1.0 xlslice_0
set_property -dict {CONFIG.DIN_FROM 2 CONFIG.DIN_TO 0 CONFIG.DIN_WIDTH 4 CONFIG.DOUT_WIDTH 3} [get_bd_cells xlslice_0]
create_bd_cell -type ip -vlnv xilinx.com:ip:xlslice:1.0 xlslice_1
set_property -dict {CONFIG.DIN_FROM 3 CONFIG.DIN_TO 3 CONFIG.DIN_WIDTH 4 CONFIG.DOUT_WIDTH 1} [get_bd_cells xlslice_1]
create_bd_cell -type hier extract_and_zeropad_gate_sigs
create_bd_cell -type ip -vlnv xilinx.com:ip:xlslice:1.0 xlslice_3
set_property -dict {CONFIG.DIN_FROM 191 CONFIG.DIN_TO 168 CONFIG.DIN_WIDTH 192 CONFIG.DOUT_WIDTH 24} [get_bd_cells xlslice_3]
create_bd_cell -type ip -vlnv xilinx.com:ip:xlslice:1.0 xlslice_4
set_property -dict {CONFIG.DIN_FROM 95 CONFIG.DIN_TO 0 CONFIG.DIN_WIDTH 192 CONFIG.DOUT_WIDTH 1} [get_bd_cells xlslice_4]
create_bd_cell -type ip -vlnv xilinx.com:ip:xlconcat:2.1 xlconcat_9
set_property -dict {CONFIG.NUM_PORTS 2 CONFIG.dout_width 120} [get_bd_cells xlconcat_9]
create_bd_cell -type ip -vlnv sintef.no:user:signal_operasjon_blokk:2.0 signal_operasjon_blokk_1
set_property -dict {CONFIG.BREDDE_INN 13 CONFIG.BREDDE_UT 14 CONFIG.FORTEGN 1} [get_bd_cells signal_operasjon_blokk_1]
create_bd_cell -type ip -vlnv sintef.no:user:signal_operasjon_blokk:2.0 signal_operasjon_blokk_2
set_property -dict {CONFIG.BREDDE_INN 13 CONFIG.BREDDE_UT 14 CONFIG.FORTEGN 1} [get_bd_cells signal_operasjon_blokk_2]
create_bd_cell -type ip -vlnv sintef.no:user:signal_operasjon_blokk:2.0 signal_operasjon_blokk_3
set_property -dict {CONFIG.BREDDE_INN 13 CONFIG.BREDDE_UT 14 CONFIG.FORTEGN 1} [get_bd_cells signal_operasjon_blokk_3]
create_bd_cell -type ip -vlnv User_Company:SysGen:blankingtimecorr:1.0 blankingtimecorr_0

# ---- hierarchy /converter_1/extract_and_zeropad_gate_sigs ----
current_bd_instance /converter_1/extract_and_zeropad_gate_sigs
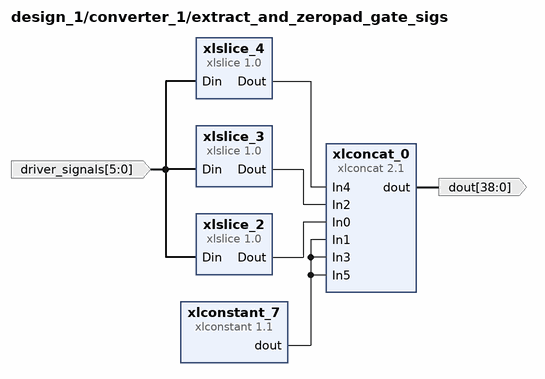
[diagram p6: block diagram inside /converter_1/extract_and_zeropad_gate_sigs]
create_bd_pin -dir I -from 5 -to 0 driver_signals
create_bd_pin -dir O -from 38 -to 0 dout

create_bd_cell -type ip -vlnv xilinx.com:ip:xlslice:1.0 xlslice_2
set_property -dict {CONFIG.DIN_FROM 1 CONFIG.DIN_TO 1 CONFIG.DIN_WIDTH 6 CONFIG.DOUT_WIDTH 1} [get_bd_cells xlslice_2]
create_bd_cell -type ip -vlnv xilinx.com:ip:xlslice:1.0 xlslice_3
set_property -dict {CONFIG.DIN_FROM 3 CONFIG.DIN_TO 3 CONFIG.DIN_WIDTH 6 CONFIG.DOUT_WIDTH 1} [get_bd_cells xlslice_3]
create_bd_cell -type ip -vlnv xilinx.com:ip:xlslice:1.0 xlslice_4
set_property -dict {CONFIG.DIN_FROM 5 CONFIG.DIN_TO 5 CONFIG.DIN_WIDTH 6 CONFIG.DOUT_WIDTH 1} [get_bd_cells xlslice_4]
create_bd_cell -type ip -vlnv xilinx.com:ip:xlconstant:1.1 xlconstant_7
set_property -dict {CONFIG.CONST_VAL 0 CONFIG.CONST_WIDTH 12} [get_bd_cells xlconstant_7]
create_bd_cell -type ip -vlnv xilinx.com:ip:xlconcat:2.1 xlconcat_0
set_property -dict {CONFIG.NUM_PORTS 6} [get_bd_cells xlconcat_0]

# ---- hierarchy /converter_2 ----
current_bd_instance /converter_2
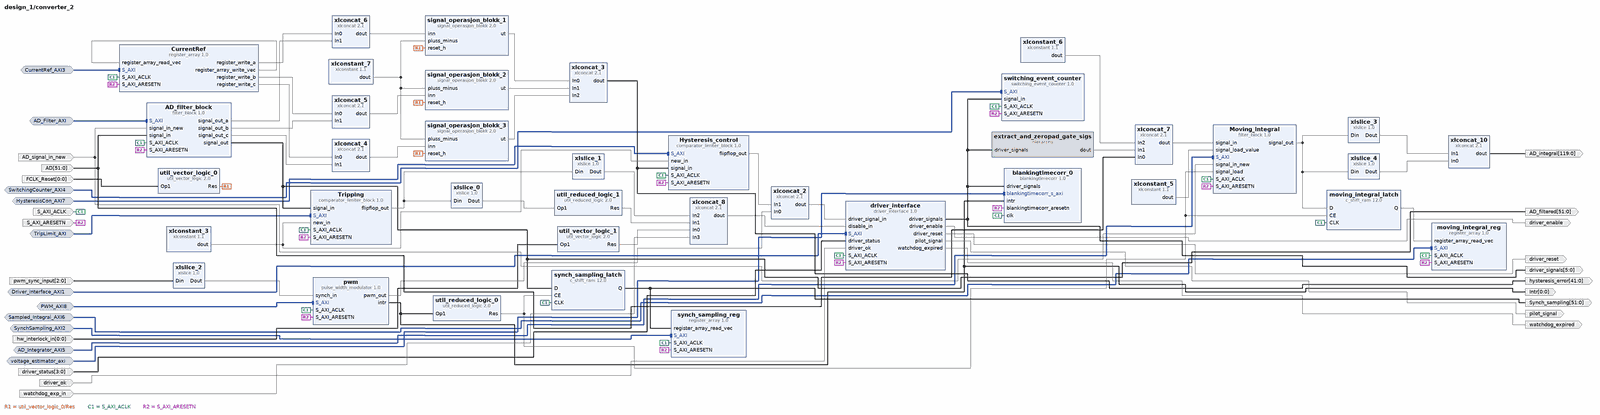
[diagram p7: block diagram inside /converter_2, whole]
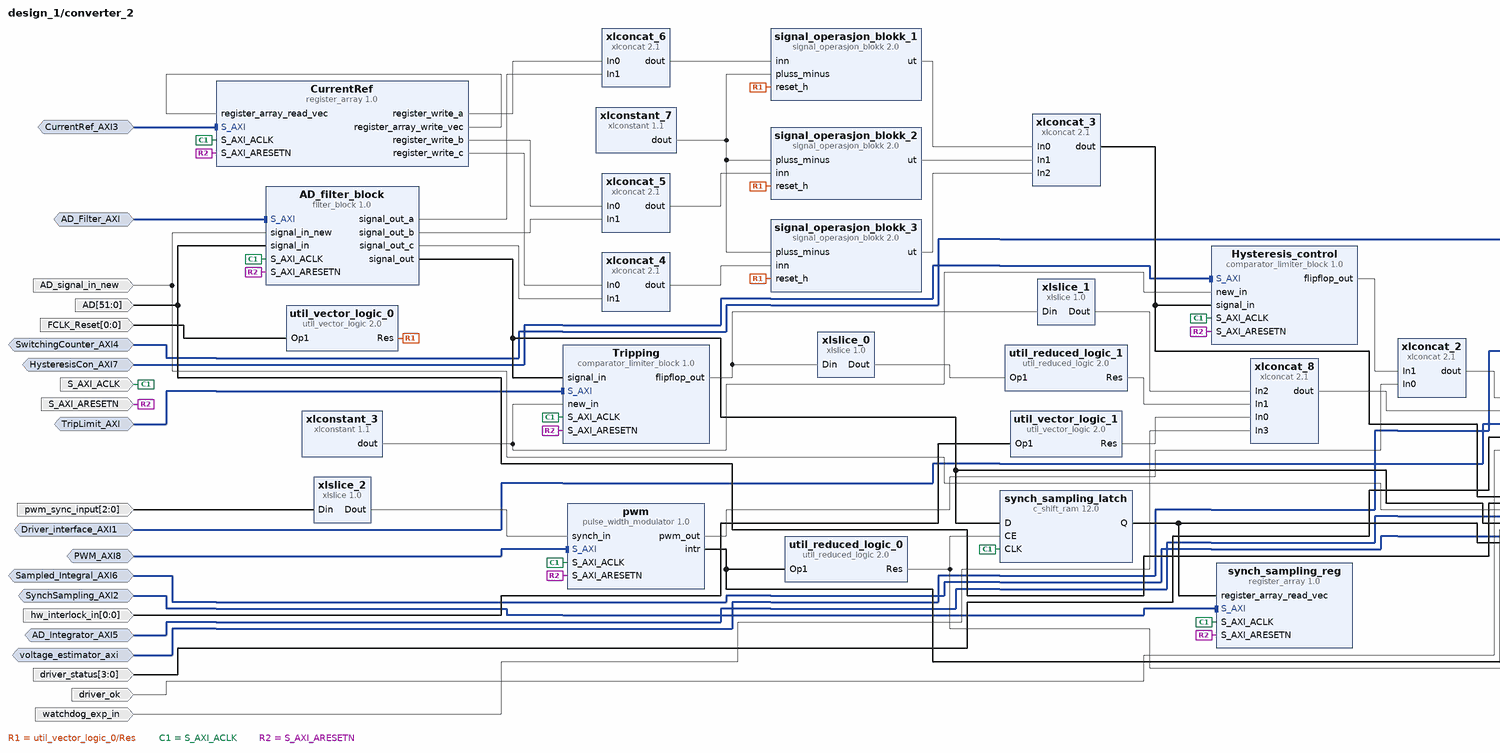
[diagram p8: block diagram inside /converter_2, left part]
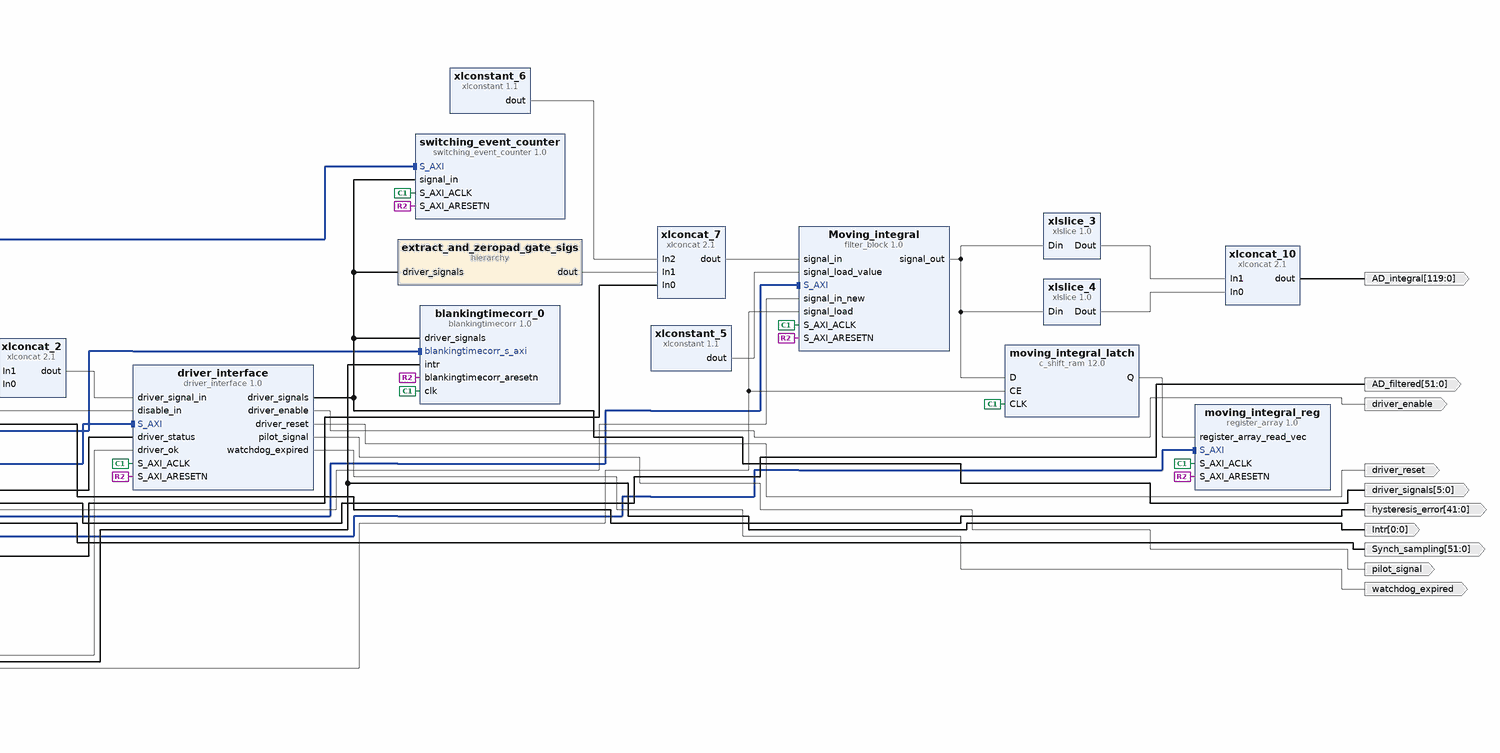
[diagram p9: block diagram inside /converter_2, right part]
create_bd_intf_pin -mode Slave -vlnv xilinx.com:interface:aximm_rtl:1.0 AD_Filter_AXI
create_bd_intf_pin -mode Slave -vlnv xilinx.com:interface:aximm_rtl:1.0 Driver_interface_AXI1
create_bd_intf_pin -mode Slave -vlnv xilinx.com:interface:aximm_rtl:1.0 SynchSampling_AXI2
create_bd_intf_pin -mode Slave -vlnv xilinx.com:interface:aximm_rtl:1.0 CurrentRef_AXI3
create_bd_intf_pin -mode Slave -vlnv xilinx.com:interface:aximm_rtl:1.0 SwitchingCounter_AXI4
create_bd_intf_pin -mode Slave -vlnv xilinx.com:interface:aximm_rtl:1.0 AD_Integrator_AXI5
create_bd_intf_pin -mode Slave -vlnv xilinx.com:interface:aximm_rtl:1.0 Sampled_Integral_AXI6
create_bd_intf_pin -mode Slave -vlnv xilinx.com:interface:aximm_rtl:1.0 HysteresisCon_AXI7
create_bd_intf_pin -mode Slave -vlnv xilinx.com:interface:aximm_rtl:1.0 PWM_AXI8
create_bd_intf_pin -mode Slave -vlnv xilinx.com:interface:aximm_rtl:1.0 voltage_estimator_axi
create_bd_intf_pin -mode Slave -vlnv xilinx.com:interface:aximm_rtl:1.0 TripLimit_AXI
create_bd_pin -dir I AD_signal_in_new
create_bd_pin -dir O -from 51 -to 0 -type data AD_filtered
create_bd_pin -dir I -type clk S_AXI_ACLK
create_bd_pin -dir I -type rst S_AXI_ARESETN
create_bd_pin -dir I -from 3 -to 0 driver_status
create_bd_pin -dir I driver_ok
create_bd_pin -dir O driver_enable
create_bd_pin -dir O -from 5 -to 0 driver_signals
create_bd_pin -dir O driver_reset
create_bd_pin -dir I -from 0 -to 0 hw_interlock_in
create_bd_pin -dir I -from 0 -to 0 FCLK_Reset
create_bd_pin -dir O -from 41 -to 0 hysteresis_error
create_bd_pin -dir O -from 119 -to 0 AD_integral
create_bd_pin -dir O -from 0 -to 0 Intr
create_bd_pin -dir O pilot_signal
create_bd_pin -dir O watchdog_expired
create_bd_pin -dir I -from 51 -to 0 AD
create_bd_pin -dir O -from 51 -to 0 Synch_sampling
create_bd_pin -dir I watchdog_exp_in
create_bd_pin -dir I -from 2 -to 0 pwm_sync_input

create_bd_cell -type ip -vlnv sintef.no:user:filter_block:1.0 AD_filter_block
set_property -dict [list \
  CONFIG.NUMBER_OF_CHANNELS 4 \
  CONFIG.SIGNAL_IN_WIDTH 13 \
  CONFIG.SIGNAL_OUT_WIDTH 13 \
] [get_bd_cells AD_filter_block]
create_bd_cell -type ip -vlnv sintef.no:user:driver_interface:1.0 driver_interface
set_property -dict [list \
  CONFIG.NUMBER_OF_DISABLE_IN_SIGNALS 4 \
  CONFIG.NUMBER_OF_SIGNAL_SOURCES 2 \
  CONFIG.USE_WATCHDOG_TIMER 1 \
] [get_bd_cells driver_interface]
create_bd_cell -type ip -vlnv sintef.no:user:register_array:1.0 synch_sampling_reg
set_property -dict {CONFIG.NUMBER_OF_REGISTERS 4 CONFIG.REGISTER_WIDTH 13 CONFIG.REG_SIGNED 1} [get_bd_cells synch_sampling_reg]
create_bd_cell -type ip -vlnv xilinx.com:ip:util_vector_logic:2.0 util_vector_logic_0
set_property -dict {CONFIG.C_OPERATION not CONFIG.C_SIZE 1} [get_bd_cells util_vector_logic_0]
create_bd_cell -type ip -vlnv sintef.no:user:register_array:1.0 CurrentRef
set_property -dict {CONFIG.NUMBER_OF_REGISTERS 3 CONFIG.REGISTER_WIDTH 13 CONFIG.REG_SIGNED 1} [get_bd_cells CurrentRef]
create_bd_cell -type ip -vlnv sintef.no:user:switching_event_counter:1.0 switching_event_counter
set_property -dict {CONFIG.NUMBER_OF_CHANNELS 6} [get_bd_cells switching_event_counter]
create_bd_cell -type ip -vlnv sintef.no:user:filter_block:1.0 Moving_integral
set_property -dict [list \
  CONFIG.NUMBER_OF_CHANNELS 8 \
  CONFIG.OPERATION_MODE 0 \
  CONFIG.SIGNAL_IN_WIDTH 13 \
  CONFIG.SIGNAL_OUT_WIDTH 24 \
] [get_bd_cells Moving_integral]
create_bd_cell -type ip -vlnv sintef.no:user:register_array:1.0 moving_integral_reg
set_property -dict {CONFIG.NUMBER_OF_REGISTERS 8 CONFIG.REGISTER_WIDTH 24 CONFIG.REG_SIGNED 1} [get_bd_cells moving_integral_reg]
create_bd_cell -type ip -vlnv sintef.no:user:comparator_limiter_block:1.0 Hysteresis_control
set_property -dict [list \
  CONFIG.NUMBER_OF_CHANNELS 3 \
  CONFIG.READ_CLIPPED_SIGNALS 0 \
  CONFIG.REGISTER_CLEAR_MASK 0x00000001 \
  CONFIG.REGISTER_SET_MASK 0x00000002 \
  CONFIG.SEPARATE_REFERENCES 0 \
  CONFIG.WIDTH_IN 14 \
  CONFIG.WIDTH_OUT 13 \
] [get_bd_cells Hysteresis_control]
create_bd_cell -type ip -vlnv sintef.no:user:pulse_width_modulator:1.0 pwm
set_property -dict {CONFIG.HYSTERESIS_DEFAULT_VALUE 0 CONFIG.INTERRUPT_DIVISOR_WIDTH 8} [get_bd_cells pwm]
create_bd_cell -type ip -vlnv xilinx.com:ip:util_vector_logic:2.0 util_vector_logic_1
set_property -dict {CONFIG.C_OPERATION not CONFIG.C_SIZE 1} [get_bd_cells util_vector_logic_1]
create_bd_cell -type ip -vlnv sintef.no:user:comparator_limiter_block:1.0 Tripping
set_property -dict [list \
  CONFIG.NUMBER_OF_CHANNELS 4 \
  CONFIG.READ_CLIPPED_SIGNALS 0 \
  CONFIG.REFERENCE_SELECTOR 0 \
  CONFIG.REGISTER_CLEAR_MASK 0x00000000 \
  CONFIG.REGISTER_SET_MASK 0x00000003 \
  CONFIG.SEPARATE_REFERENCES 1 \
  CONFIG.WIDTH_IN 13 \
  CONFIG.WIDTH_OUT 13 \
] [get_bd_cells Tripping]
create_bd_cell -type ip -vlnv xilinx.com:ip:c_shift_ram:12.0 moving_integral_latch
set_property -dict [list \
  CONFIG.AsyncInitVal 000000000000000000000000000000000000000000000000000000000000000000000000000000000000000000000000000000000000000000000000000000000000000000000000000000000000000000000000000000000000000000000000 \
  CONFIG.CE true \
  CONFIG.DefaultData 000000000000000000000000000000000000000000000000000000000000000000000000000000000000000000000000000000000000000000000000000000000000000000000000000000000000000000000000000000000000000000000000 \
  CONFIG.Depth 1 \
  CONFIG.Width 192 \
] [get_bd_cells moving_integral_latch]
create_bd_cell -type ip -vlnv xilinx.com:ip:c_shift_ram:12.0 synch_sampling_latch
set_property -dict [list \
  CONFIG.AsyncInitVal 0000000000000000000000000000000000000000000000000000 \
  CONFIG.CE true \
  CONFIG.DefaultData 0000000000000000000000000000000000000000000000000000 \
  CONFIG.Depth 1 \
  CONFIG.Width 52 \
] [get_bd_cells synch_sampling_latch]
create_bd_cell -type ip -vlnv xilinx.com:ip:util_reduced_logic:2.0 util_reduced_logic_0
set_property -dict {CONFIG.C_SIZE 1} [get_bd_cells util_reduced_logic_0]
create_bd_cell -type ip -vlnv xilinx.com:ip:util_reduced_logic:2.0 util_reduced_logic_1
set_property -dict {CONFIG.C_OPERATION or CONFIG.C_SIZE 3} [get_bd_cells util_reduced_logic_1]
create_bd_cell -type ip -vlnv xilinx.com:ip:xlconcat:2.1 xlconcat_2
set_property -dict {CONFIG.dout_width 6} [get_bd_cells xlconcat_2]
create_bd_cell -type ip -vlnv xilinx.com:ip:xlconcat:2.1 xlconcat_3
set_property -dict {CONFIG.NUM_PORTS 3 CONFIG.dout_width 42} [get_bd_cells xlconcat_3]
create_bd_cell -type ip -vlnv xilinx.com:ip:xlconcat:2.1 xlconcat_4
set_property -dict {CONFIG.NUM_PORTS 2 CONFIG.dout_width 26} [get_bd_cells xlconcat_4]
create_bd_cell -type ip -vlnv xilinx.com:ip:xlconcat:2.1 xlconcat_5
set_property -dict {CONFIG.NUM_PORTS 2 CONFIG.dout_width 26} [get_bd_cells xlconcat_5]
create_bd_cell -type ip -vlnv xilinx.com:ip:xlconcat:2.1 xlconcat_6
set_property -dict {CONFIG.NUM_PORTS 2 CONFIG.dout_width 26} [get_bd_cells xlconcat_6]
create_bd_cell -type ip -vlnv xilinx.com:ip:xlconcat:2.1 xlconcat_7
set_property -dict [list \
  CONFIG.IN0_WIDTH 52 \
  CONFIG.IN1_WIDTH 39 \
  CONFIG.IN2_WIDTH 13 \
  CONFIG.NUM_PORTS 3 \
  CONFIG.dout_width 104 \
] [get_bd_cells xlconcat_7]
create_bd_cell -type ip -vlnv xilinx.com:ip:xlconcat:2.1 xlconcat_8
set_property -dict {CONFIG.IN0_WIDTH 1 CONFIG.IN1_WIDTH 1 CONFIG.NUM_PORTS 4 CONFIG.dout_width 4} [get_bd_cells xlconcat_8]
create_bd_cell -type ip -vlnv xilinx.com:ip:xlconstant:1.1 xlconstant_3
set_property -dict {CONFIG.CONST_VAL 1 CONFIG.CONST_WIDTH 1} [get_bd_cells xlconstant_3]
create_bd_cell -type ip -vlnv xilinx.com:ip:xlconstant:1.1 xlconstant_5
set_property -dict {CONFIG.CONST_VAL 0 CONFIG.CONST_WIDTH 192} [get_bd_cells xlconstant_5]
create_bd_cell -type ip -vlnv xilinx.com:ip:xlconstant:1.1 xlconstant_6
set_property -dict {CONFIG.CONST_VAL 1 CONFIG.CONST_WIDTH 13} [get_bd_cells xlconstant_6]
create_bd_cell -type ip -vlnv xilinx.com:ip:xlconstant:1.1 xlconstant_7
set_property -dict {CONFIG.CONST_VAL 2 CONFIG.CONST_WIDTH 2} [get_bd_cells xlconstant_7]
create_bd_cell -type ip -vlnv xilinx.com:ip:xlslice:1.0 xlslice_0
set_property -dict {CONFIG.DIN_FROM 2 CONFIG.DIN_TO 0 CONFIG.DIN_WIDTH 4 CONFIG.DOUT_WIDTH 3} [get_bd_cells xlslice_0]
create_bd_cell -type ip -vlnv xilinx.com:ip:xlslice:1.0 xlslice_1
set_property -dict {CONFIG.DIN_FROM 3 CONFIG.DIN_TO 3 CONFIG.DIN_WIDTH 4 CONFIG.DOUT_WIDTH 1} [get_bd_cells xlslice_1]
create_bd_cell -type hier extract_and_zeropad_gate_sigs
create_bd_cell -type ip -vlnv xilinx.com:ip:xlslice:1.0 xlslice_3
set_property -dict {CONFIG.DIN_FROM 191 CONFIG.DIN_TO 168 CONFIG.DIN_WIDTH 192 CONFIG.DOUT_WIDTH 1} [get_bd_cells xlslice_3]
create_bd_cell -type ip -vlnv xilinx.com:ip:xlslice:1.0 xlslice_4
set_property -dict {CONFIG.DIN_FROM 95 CONFIG.DIN_TO 0 CONFIG.DIN_WIDTH 192 CONFIG.DOUT_WIDTH 1} [get_bd_cells xlslice_4]
create_bd_cell -type ip -vlnv xilinx.com:ip:xlconcat:2.1 xlconcat_10
set_property -dict {CONFIG.NUM_PORTS 2 CONFIG.dout_width 120} [get_bd_cells xlconcat_10]
create_bd_cell -type ip -vlnv sintef.no:user:signal_operasjon_blokk:2.0 signal_operasjon_blokk_1
set_property -dict {CONFIG.BREDDE_INN 13 CONFIG.BREDDE_UT 14 CONFIG.FORTEGN 1} [get_bd_cells signal_operasjon_blokk_1]
create_bd_cell -type ip -vlnv sintef.no:user:signal_operasjon_blokk:2.0 signal_operasjon_blokk_2
set_property -dict {CONFIG.BREDDE_INN 13 CONFIG.BREDDE_UT 14 CONFIG.FORTEGN 1} [get_bd_cells signal_operasjon_blokk_2]
create_bd_cell -type ip -vlnv sintef.no:user:signal_operasjon_blokk:2.0 signal_operasjon_blokk_3
set_property -dict {CONFIG.BREDDE_INN 13 CONFIG.BREDDE_UT 14 CONFIG.FORTEGN 1} [get_bd_cells signal_operasjon_blokk_3]
create_bd_cell -type ip -vlnv User_Company:SysGen:blankingtimecorr:1.0 blankingtimecorr_0
create_bd_cell -type ip -vlnv xilinx.com:ip:xlslice:1.0 xlslice_2
set_property -dict {CONFIG.DIN_FROM 0 CONFIG.DIN_TO 0 CONFIG.DIN_WIDTH 3} [get_bd_cells xlslice_2]

# ---- hierarchy /converter_2/extract_and_zeropad_gate_sigs ----
current_bd_instance /converter_2/extract_and_zeropad_gate_sigs
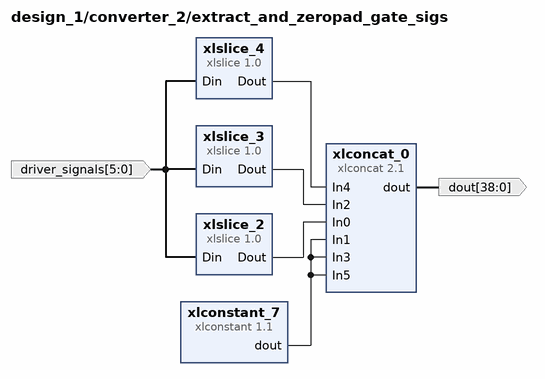
[diagram p10: block diagram inside /converter_2/extract_and_zeropad_gate_sigs]
create_bd_pin -dir I -from 5 -to 0 driver_signals
create_bd_pin -dir O -from 38 -to 0 dout

create_bd_cell -type ip -vlnv xilinx.com:ip:xlslice:1.0 xlslice_2
set_property -dict {CONFIG.DIN_FROM 1 CONFIG.DIN_TO 1 CONFIG.DIN_WIDTH 6 CONFIG.DOUT_WIDTH 1} [get_bd_cells xlslice_2]
create_bd_cell -type ip -vlnv xilinx.com:ip:xlslice:1.0 xlslice_3
set_property -dict {CONFIG.DIN_FROM 3 CONFIG.DIN_TO 3 CONFIG.DIN_WIDTH 6 CONFIG.DOUT_WIDTH 1} [get_bd_cells xlslice_3]
create_bd_cell -type ip -vlnv xilinx.com:ip:xlslice:1.0 xlslice_4
set_property -dict {CONFIG.DIN_FROM 5 CONFIG.DIN_TO 5 CONFIG.DIN_WIDTH 6 CONFIG.DOUT_WIDTH 1} [get_bd_cells xlslice_4]
create_bd_cell -type ip -vlnv xilinx.com:ip:xlconstant:1.1 xlconstant_7
set_property -dict {CONFIG.CONST_VAL 0 CONFIG.CONST_WIDTH 12} [get_bd_cells xlconstant_7]
create_bd_cell -type ip -vlnv xilinx.com:ip:xlconcat:2.1 xlconcat_0
set_property -dict {CONFIG.NUM_PORTS 6} [get_bd_cells xlconcat_0]

# ---- connections ----

current_bd_instance /converter_1
connect_bd_intf_net [get_bd_intf_pins CurrentRef_AXI3] [get_bd_intf_pins CurrentRef/S_AXI]
connect_bd_intf_net [get_bd_intf_pins AD_Filter_AXI] [get_bd_intf_pins AD_filter_block/S_AXI]
connect_bd_intf_net [get_bd_intf_pins Driver_interface_AXI1] [get_bd_intf_pins driver_interface/S_AXI]
connect_bd_intf_net [get_bd_intf_pins TripLimit_AXI] [get_bd_intf_pins Tripping/S_AXI]
connect_bd_intf_net [get_bd_intf_pins HysteresisCon_AXI7] [get_bd_intf_pins Hysteresis_control/S_AXI]
connect_bd_intf_net [get_bd_intf_pins Sampled_Integral_AXI6] [get_bd_intf_pins moving_integral_reg/S_AXI]
connect_bd_intf_net [get_bd_intf_pins SwitchingCounter_AXI4] [get_bd_intf_pins switching_event_counter/S_AXI]
connect_bd_intf_net [get_bd_intf_pins AD_Integrator_AXI5] [get_bd_intf_pins Moving_integral/S_AXI]
connect_bd_intf_net [get_bd_intf_pins SynchSampling_AXI2] [get_bd_intf_pins synch_sampling_reg/S_AXI]
connect_bd_intf_net [get_bd_intf_pins voltage_estimator_axi] [get_bd_intf_pins blankingtimecorr_0/blankingtimecorr_s_axi]
connect_bd_intf_net [get_bd_intf_pins PWM_AXI8] [get_bd_intf_pins pwm/S_AXI]
connect_bd_net [get_bd_pins AD_filter_block/signal_out_a] [get_bd_pins xlconcat_6/In1]
connect_bd_net [get_bd_pins AD_filter_block/signal_out_b] [get_bd_pins xlconcat_5/In1]
connect_bd_net [get_bd_pins AD_filter_block/signal_out_c] [get_bd_pins xlconcat_4/In1]
connect_bd_net [get_bd_pins xlconcat_2/dout] [get_bd_pins driver_interface/driver_signal_in]
connect_bd_net [get_bd_pins util_vector_logic_0/Res] \
  [get_bd_pins signal_operasjon_blokk_1/reset_h] [get_bd_pins signal_operasjon_blokk_2/reset_h] \
  [get_bd_pins signal_operasjon_blokk_3/reset_h]
connect_bd_net -net register_array_0_register_array_write_vec [get_bd_pins CurrentRef/register_array_write_vec] \
  [get_bd_pins CurrentRef/register_array_read_vec]
connect_bd_net -net register_array_0_register_write_a [get_bd_pins CurrentRef/register_write_a] [get_bd_pins xlconcat_6/In0]
connect_bd_net -net register_array_0_register_write_b [get_bd_pins CurrentRef/register_write_b] [get_bd_pins xlconcat_5/In0]
connect_bd_net -net register_array_0_register_write_c [get_bd_pins CurrentRef/register_write_c] [get_bd_pins xlconcat_4/In0]
connect_bd_net -net pwm_2_pwm_out [get_bd_pins pwm/pwm_out] [get_bd_pins xlconcat_2/In0]
connect_bd_net -net comparator_limiter_block_0_flipflop_out [get_bd_pins Hysteresis_control/flipflop_out] [get_bd_pins xlconcat_2/In1]
connect_bd_net [get_bd_pins signal_operasjon_blokk_1/ut] [get_bd_pins xlconcat_3/In0]
connect_bd_net [get_bd_pins signal_operasjon_blokk_2/ut] [get_bd_pins xlconcat_3/In1]
connect_bd_net [get_bd_pins signal_operasjon_blokk_3/ut] [get_bd_pins xlconcat_3/In2]
connect_bd_net [get_bd_pins xlconcat_6/dout] [get_bd_pins signal_operasjon_blokk_1/inn]
connect_bd_net [get_bd_pins xlconcat_4/dout] [get_bd_pins signal_operasjon_blokk_3/inn]
connect_bd_net [get_bd_pins xlconcat_5/dout] [get_bd_pins signal_operasjon_blokk_2/inn]
connect_bd_net [get_bd_pins xlconcat_7/dout] [get_bd_pins Moving_integral/signal_in]
connect_bd_net -net ad_converter_serial_receiver_0_ad_signal_new_busclk [get_bd_pins AD_signal_in_new] \
  [get_bd_pins Moving_integral/signal_in_new] [get_bd_pins AD_filter_block/signal_in_new]
connect_bd_net -net ad_converter_ad_signal_out [get_bd_pins AD] [get_bd_pins AD_filter_block/signal_in] [get_bd_pins xlconcat_7/In0]
connect_bd_net -net filter_block_1_signal_out [get_bd_pins AD_filter_block/signal_out] \
  [get_bd_pins AD_filtered] [get_bd_pins Tripping/signal_in] [get_bd_pins synch_sampling_latch/D]
connect_bd_net -net processing_system7_0_FCLK_CLK0 [get_bd_pins S_AXI_ACLK] \
  [get_bd_pins Moving_integral/S_AXI_ACLK] [get_bd_pins Hysteresis_control/S_AXI_ACLK] \
  [get_bd_pins driver_interface/S_AXI_ACLK] [get_bd_pins moving_integral_reg/S_AXI_ACLK] [get_bd_pins pwm/S_AXI_ACLK] \
  [get_bd_pins CurrentRef/S_AXI_ACLK] [get_bd_pins switching_event_counter/S_AXI_ACLK] \
  [get_bd_pins synch_sampling_reg/S_AXI_ACLK] [get_bd_pins AD_filter_block/S_AXI_ACLK] [get_bd_pins Tripping/S_AXI_ACLK] \
  [get_bd_pins moving_integral_latch/CLK] [get_bd_pins synch_sampling_latch/CLK] [get_bd_pins blankingtimecorr_0/clk]
connect_bd_net -net rst_ps7_0_100M_peripheral_aresetn [get_bd_pins S_AXI_ARESETN] \
  [get_bd_pins Moving_integral/S_AXI_ARESETN] [get_bd_pins Hysteresis_control/S_AXI_ARESETN] \
  [get_bd_pins driver_interface/S_AXI_ARESETN] [get_bd_pins moving_integral_reg/S_AXI_ARESETN] \
  [get_bd_pins pwm/S_AXI_ARESETN] [get_bd_pins CurrentRef/S_AXI_ARESETN] [get_bd_pins switching_event_counter/S_AXI_ARESETN] \
  [get_bd_pins synch_sampling_reg/S_AXI_ARESETN] [get_bd_pins AD_filter_block/S_AXI_ARESETN] \
  [get_bd_pins Tripping/S_AXI_ARESETN] [get_bd_pins blankingtimecorr_0/blankingtimecorr_aresetn]
connect_bd_net [get_bd_pins driver_status] [get_bd_pins driver_interface/driver_status]
connect_bd_net [get_bd_pins driver_ok] [get_bd_pins driver_interface/driver_ok]
connect_bd_net -net driver_interface_2_driver_enable [get_bd_pins driver_interface/driver_enable] [get_bd_pins driver_enable]
connect_bd_net -net driver_interface_2_driver_signals [get_bd_pins driver_interface/driver_signals] \
  [get_bd_pins driver_signals] [get_bd_pins switching_event_counter/signal_in] \
  [get_bd_pins extract_and_zeropad_gate_sigs/driver_signals] [get_bd_pins blankingtimecorr_0/driver_signals]
connect_bd_net -net driver_interface_2_driver_reset [get_bd_pins driver_interface/driver_reset] [get_bd_pins driver_reset]
connect_bd_net -net driver_interface_1_watchdog_expired [get_bd_pins hw_interlock_in] [get_bd_pins util_vector_logic_1/Op1]
connect_bd_net -net synch_sampling_Q [get_bd_pins synch_sampling_latch/Q] \
  [get_bd_pins Synch_sampling] [get_bd_pins synch_sampling_reg/register_array_read_vec]
connect_bd_net -net processing_system7_0_FCLK_RESET0_N [get_bd_pins FCLK_Reset] [get_bd_pins util_vector_logic_0/Op1]
connect_bd_net [get_bd_pins util_reduced_logic_0/Res] \
  [get_bd_pins Moving_integral/signal_load] [get_bd_pins moving_integral_latch/CE] [get_bd_pins synch_sampling_latch/CE]
connect_bd_net [get_bd_pins xlconcat_3/dout] [get_bd_pins hysteresis_error] [get_bd_pins Hysteresis_control/signal_in]
connect_bd_net -net filter_block_0_signal_out [get_bd_pins Moving_integral/signal_out] \
  [get_bd_pins moving_integral_latch/D] [get_bd_pins xlslice_3/Din] [get_bd_pins xlslice_4/Din]
connect_bd_net [get_bd_pins moving_integral_latch/Q] [get_bd_pins moving_integral_reg/register_array_read_vec]
connect_bd_net [get_bd_pins xlconstant_3/dout] [get_bd_pins Hysteresis_control/new_in] [get_bd_pins Tripping/new_in]
connect_bd_net -net pwm_2_intr [get_bd_pins pwm/intr] [get_bd_pins Intr] [get_bd_pins util_reduced_logic_0/Op1] [get_bd_pins blankingtimecorr_0/intr]
connect_bd_net -net driver_interface_2_pilot_signal [get_bd_pins driver_interface/pilot_signal] [get_bd_pins pilot_signal]
connect_bd_net -net driver_interface_2_watchdog_expired [get_bd_pins driver_interface/watchdog_expired] [get_bd_pins watchdog_expired]
connect_bd_net [get_bd_pins xlconstant_5/dout] [get_bd_pins Moving_integral/signal_load_value]
connect_bd_net [get_bd_pins xlconcat_8/dout] [get_bd_pins driver_interface/disable_in]
connect_bd_net [get_bd_pins util_vector_logic_1/Res] [get_bd_pins xlconcat_8/In0]
connect_bd_net [get_bd_pins util_reduced_logic_1/Res] [get_bd_pins xlconcat_8/In1]
connect_bd_net [get_bd_pins Tripping/flipflop_out] [get_bd_pins xlslice_0/Din] [get_bd_pins xlslice_1/Din]
connect_bd_net [get_bd_pins xlslice_0/Dout] [get_bd_pins util_reduced_logic_1/Op1]
connect_bd_net [get_bd_pins xlslice_1/Dout] [get_bd_pins xlconcat_8/In2]
connect_bd_net [get_bd_pins watchdog_exp_in] [get_bd_pins xlconcat_8/In3]
connect_bd_net [get_bd_pins xlconstant_8/dout] \
  [get_bd_pins signal_operasjon_blokk_1/pluss_minus] [get_bd_pins signal_operasjon_blokk_2/pluss_minus] \
  [get_bd_pins signal_operasjon_blokk_3/pluss_minus]
connect_bd_net [get_bd_pins xlconstant_6/dout] [get_bd_pins xlconcat_7/In2]
connect_bd_net [get_bd_pins xlslice_4/Dout] [get_bd_pins xlconcat_9/In0]
connect_bd_net [get_bd_pins xlslice_3/Dout] [get_bd_pins xlconcat_9/In1]
connect_bd_net [get_bd_pins xlconcat_9/dout] [get_bd_pins AD_integral]
connect_bd_net [get_bd_pins extract_and_zeropad_gate_sigs/dout] [get_bd_pins xlconcat_7/In1]
connect_bd_net [get_bd_pins pwm/synch_out] [get_bd_pins pwm_synch_out]
